# EAGLE design I2C_IO_card_v3.0 (EAGLE 9.6.2)

## Sheet 1 of 2: IO isolatet expander
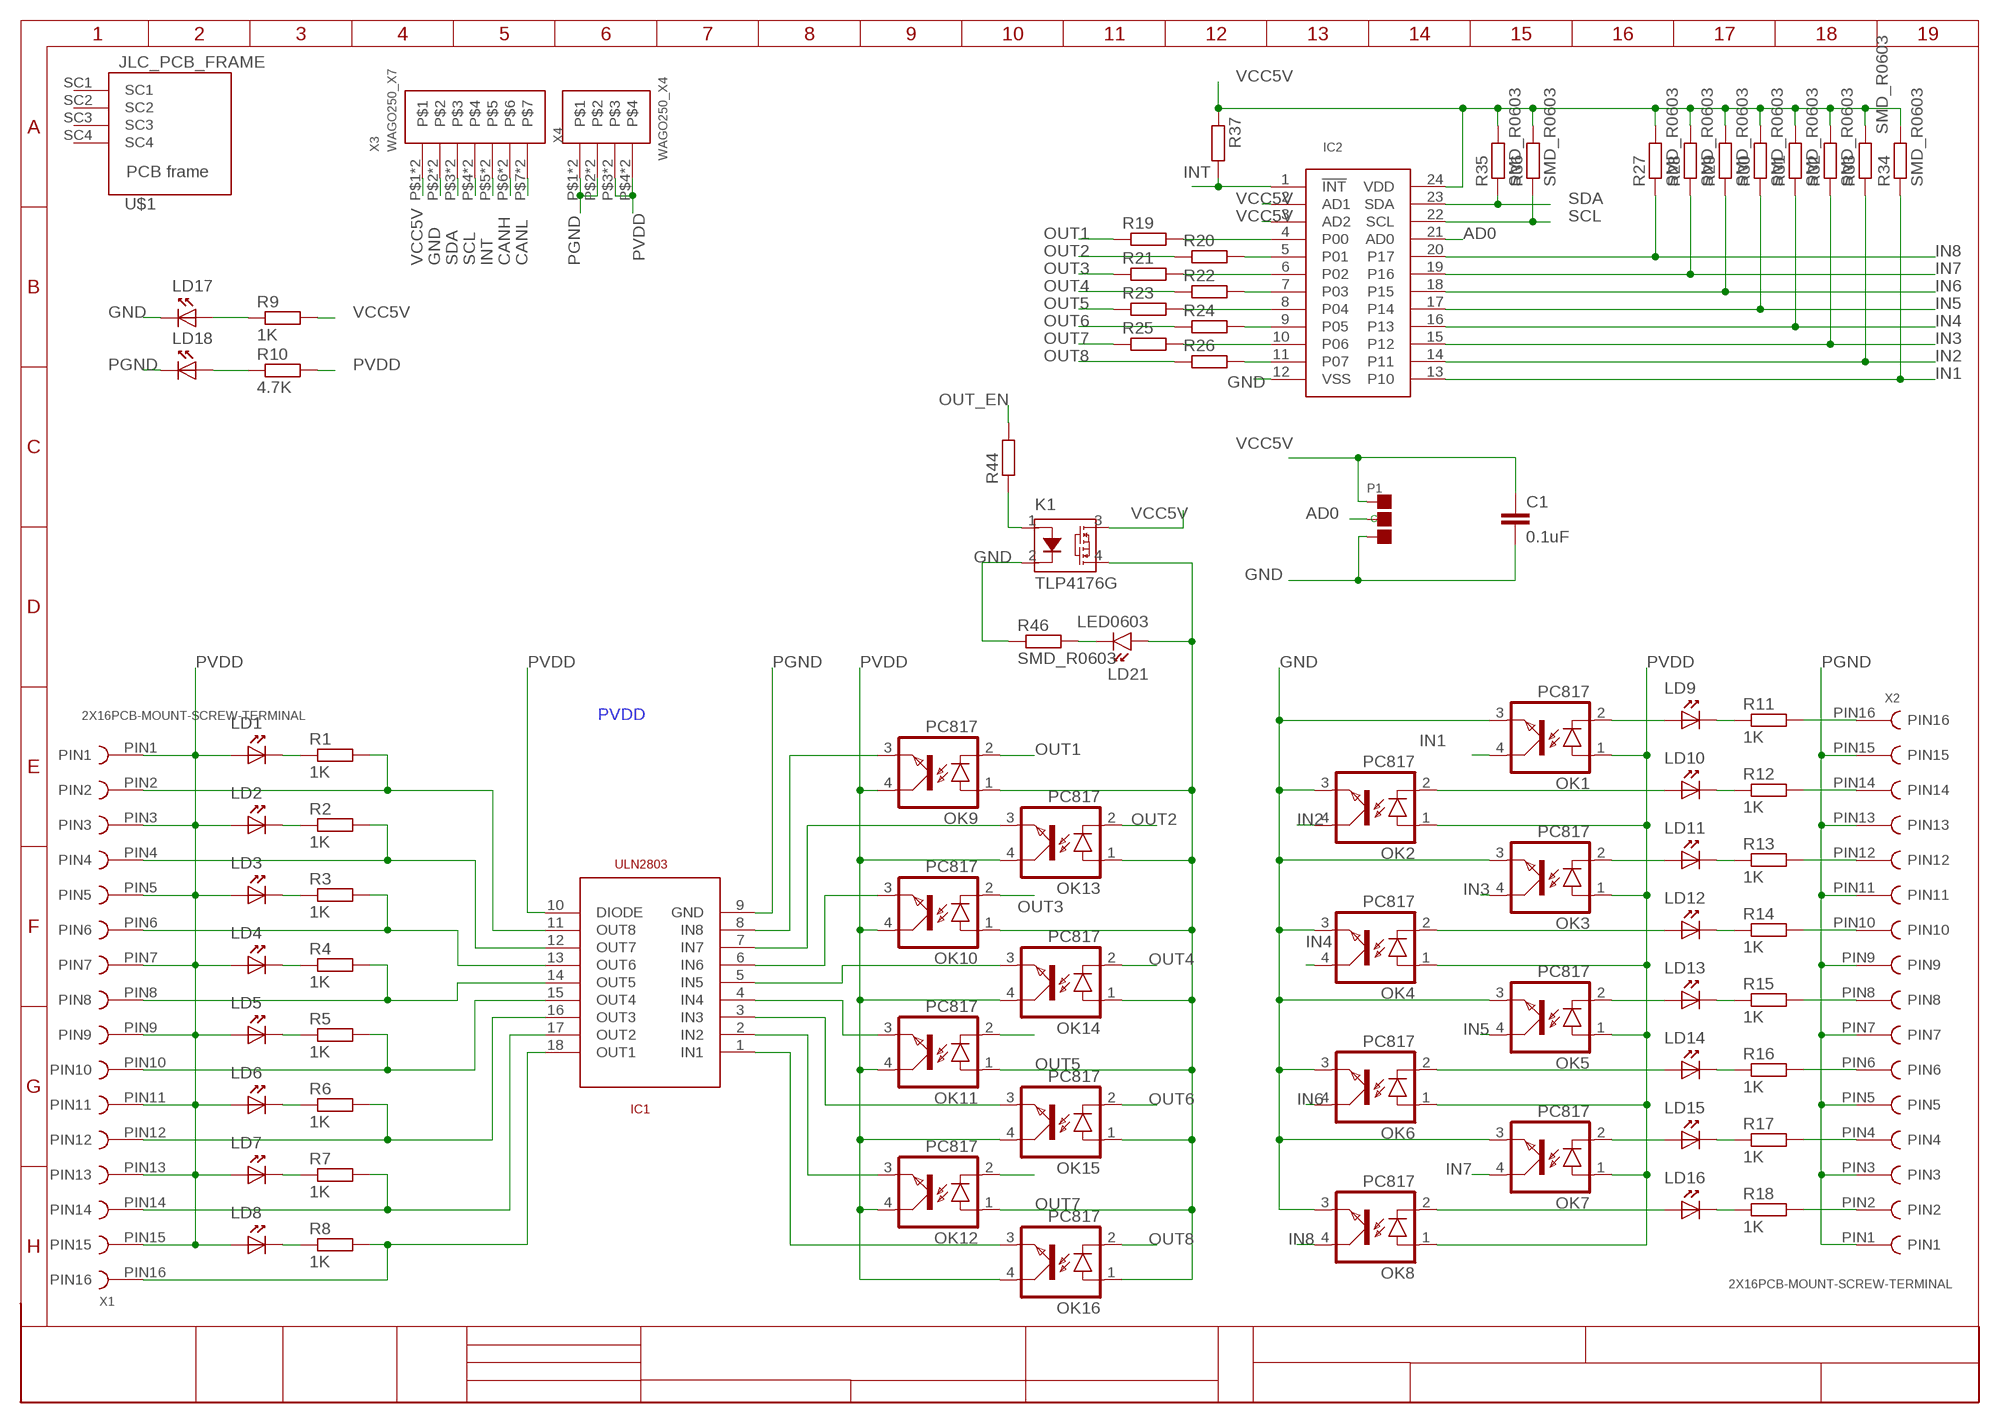
[diagram p0: schematic, sheet 1]

### Parts
C1  0.1uF  C-EUC0603K  [C0603K]
IC1  ULN2803  [SO18L]
IC2  PCA9675_TSSOP24  [SOP65P640X110-24N]
K1  TLP4176G  [SOP04]
LD1  LED  [LED_RADIAL_3MM]
LD2  LED  [LED_RADIAL_3MM]
LD3  LED  [LED_RADIAL_3MM]
LD4  LED  [LED_RADIAL_3MM]
LD5  LED  [LED_RADIAL_3MM]
LD6  LED  [LED_RADIAL_3MM]
LD7  LED  [LED_RADIAL_3MM]
LD8  LED  [LED_RADIAL_3MM]
LD9  LED  [LED_RADIAL_3MM]
LD10  LED  [LED_RADIAL_3MM]
LD11  LED  [LED_RADIAL_3MM]
LD12  LED  [LED_RADIAL_3MM]
LD13  LED  [LED_RADIAL_3MM]
LD14  LED  [LED_RADIAL_3MM]
LD15  LED  [LED_RADIAL_3MM]
LD16  LED  [LED_RADIAL_3MM]
LD17  LED  [LED_RADIAL_3MM]
LD18  LED  [LED_RADIAL_3MM]
LD21  LED0603  [0603_P]
OK1  PC817  [DIL04]
OK2  PC817  [DIL04]
OK3  PC817  [DIL04]
OK4  PC817  [DIL04]
OK5  PC817  [DIL04]
OK6  PC817  [DIL04]
OK7  PC817  [DIL04]
OK8  PC817  [DIL04]
OK9  PC817  [DIL04]
OK10  PC817  [DIL04]
OK11  PC817  [DIL04]
OK12  PC817  [DIL04]
OK13  PC817  [DIL04]
OK14  PC817  [DIL04]
OK15  PC817  [DIL04]
OK16  PC817  [DIL04]
P1  PAD-JUMPER-3P-40*40  [3P-SMD-4.1X1.5]
R1  1K  R-EU_R0603  [R0603]
R2  1K  R-EU_R0603  [R0603]
R3  1K  R-EU_R0603  [R0603]
R4  1K  R-EU_R0603  [R0603]
R5  1K  R-EU_R0603  [R0603]
R6  1K  R-EU_R0603  [R0603]
R7  1K  R-EU_R0603  [R0603]
R8  1K  R-EU_R0603  [R0603]
R9  1K  R-EU_R0603  [R0603]
R10  4.7K  R-EU_R0603  [R0603]
R11  1K  R-EU_R0603  [R0603]
R12  1K  R-EU_R0603  [R0603]
R13  1K  R-EU_R0603  [R0603]
R14  1K  R-EU_R0603  [R0603]
R15  1K  R-EU_R0603  [R0603]
R16  1K  R-EU_R0603  [R0603]
R17  1K  R-EU_R0603  [R0603]
R18  1K  R-EU_R0603  [R0603]
R19  SMD_R0603  [0603]
R20  SMD_R0603  [0603]
R21  SMD_R0603  [0603]
R22  SMD_R0603  [0603]
R23  SMD_R0603  [0603]
R24  SMD_R0603  [0603]
R25  SMD_R0603  [0603]
R26  SMD_R0603  [0603]
R27  SMD_R0603  [0603]
R28  SMD_R0603  [0603]
R29  SMD_R0603  [0603]
R30  SMD_R0603  [0603]
R31  SMD_R0603  [0603]
R32  SMD_R0603  [0603]
R33  SMD_R0603  [0603]
R34  SMD_R0603  [0603]
R35  SMD_R0603  [0603]
R36  SMD_R0603  [0603]
R37  R-EU_RO603K  [R0603K]
R44  SMD_R0603  [0603]
R46  SMD_R0603  [0603]
U$1  JLC_PCB_FRAME  [80X100_PCB_FRAME]
X1  2X16PCB-MOUNT-SCREW-TERMINAL  [2X16PCB-MOUNT-SCREW-TERMINAL]
X2  2X16PCB-MOUNT-SCREW-TERMINAL  [2X16PCB-MOUNT-SCREW-TERMINAL]
X3  WAGO250_X7  [WAGO250_FP_7X]
X4  WAGO250_X4  [WAGO250_FP_4X]

### Nets
AD0: IC2.21(AD0) P1.MM(C)
CANH: X3.P$6 X3.U$6 ; also sheet 2
CANL: X3.P$7 X3.U$7 ; also sheet 2
GND: C1.2 IC2.12(VSS) K1.2(K) LD17.K OK1.3(EMIT) OK2.3(EMIT) OK3.3(EMIT) OK4.3(EMIT) OK5.3(EMIT) OK6.3(EMIT) OK7.3(EMIT) OK8.3(EMIT) P1.11(R) R46.1 X3.P$2 X3.U$2 ; also sheet 2
IN1: IC2.13(P10) OK1.4(COL) R34.1 ; also sheet 2
IN2: IC2.14(P11) OK2.4(COL) R33.1
IN3: IC2.15(P12) OK3.4(COL) R32.1
IN4: IC2.16(P13) OK4.4(COL) R31.1
IN5: IC2.17(P14) OK5.4(COL) R30.1
IN6: IC2.18(P15) OK6.4(COL) R29.1
IN7: IC2.19(P16) OK7.4(COL) R28.1
IN8: IC2.20(P17) OK8.4(COL) R27.1
INT: IC2.1(!INT) R37.2 X3.P$5 X3.U$5 ; also sheet 2
N$1: LD1.K R1.1
N$2: LD2.K R2.1
N$3: LD3.K R3.1
N$4: LD4.K R4.1
N$5: LD5.K R5.1
N$6: LD6.K R6.1
N$7: LD7.K R7.1
N$8: LD8.K R8.1
N$9: IC1.18(OUT1) R8.2 X1.PIN16
N$10: IC1.17(OUT2) R7.2 X1.PIN14
N$11: IC1.16(OUT3) R6.2 X1.PIN12
N$12: IC1.15(OUT4) R5.2 X1.PIN10
N$13: IC1.14(OUT5) R4.2 X1.PIN8
N$14: IC1.13(OUT6) R3.2 X1.PIN6
N$15: IC1.12(OUT7) R2.2 X1.PIN4
N$16: IC1.11(OUT8) R1.2 X1.PIN2
N$17: LD17.A R9.1
N$18: LD18.A R10.1
N$19: R18.2 X2.PIN2
N$20: R17.2 X2.PIN4
N$21: R16.2 X2.PIN6
N$22: R15.2 X2.PIN8
N$23: R14.2 X2.PIN10
N$24: R13.2 X2.PIN12
N$25: R12.2 X2.PIN14
N$26: R11.2 X2.PIN16
N$27: LD9.K R11.1
N$28: LD10.K R12.1
N$29: LD11.K R13.1
N$30: LD12.K R14.1
N$31: LD13.K R15.1
N$32: LD14.K R16.1
N$33: LD15.K R17.1
N$34: LD16.K R18.1
N$35: LD9.A OK1.2(C)
N$36: LD11.A OK3.2(C)
N$37: LD13.A OK5.2(C)
N$38: LD15.A OK7.2(C)
N$39: LD16.A OK8.2(C)
N$40: LD14.A OK6.2(C)
N$41: LD12.A OK4.2(C)
N$42: LD10.A OK2.2(C)
N$43: IC2.4(P00) R19.2
N$44: IC1.8(IN8) OK9.3(EMIT)
N$45: IC1.7(IN7) OK13.3(EMIT)
N$46: IC1.6(IN6) OK10.3(EMIT)
N$47: IC1.5(IN5) OK14.3(EMIT)
N$48: IC1.4(IN4) OK11.3(EMIT)
N$49: IC1.3(IN3) OK15.3(EMIT)
N$50: IC1.2(IN2) OK12.3(EMIT)
N$51: IC1.1(IN1) OK16.3(EMIT)
N$52: IC2.5(P01) R20.2
N$53: IC2.6(P02) R21.2
N$54: IC2.7(P03) R22.2
N$55: IC2.8(P04) R23.2
N$56: IC2.9(P05) R24.2
N$57: IC2.10(P06) R25.2
N$58: IC2.11(P07) R26.2
N$67: K1.4(DS2) LD21.2(A) OK9.1(A) OK10.1(A) OK11.1(A) OK12.1(A) OK13.1(A) OK14.1(A) OK15.1(A) OK16.1(A)
N$73: K1.1(A) R44.1
N$75: LD21.1(K) R46.2
OUT1: OK9.2(C) R19.1
OUT2: OK13.2(C) R20.1
OUT3: OK10.2(C) R21.1
OUT4: OK14.2(C) R22.1
OUT5: OK11.2(C) R23.1
OUT6: OK15.2(C) R24.1
OUT7: OK12.2(C) R25.1
OUT8: OK16.2(C) R26.1
OUT_EN: R44.2 ; also sheet 2
PGND: IC1.9(GND) LD18.K X2.PIN1 X2.PIN3 X2.PIN5 X2.PIN7 X2.PIN9 X2.PIN11 X2.PIN13 X2.PIN15 X4.P$1 X4.P$2 X4.U$1 X4.U$2 ; also sheet 2
PVDD: IC1.10(DIODE) LD1.A LD2.A LD3.A LD4.A LD5.A LD6.A LD7.A LD8.A OK1.1(A) OK2.1(A) OK3.1(A) OK4.1(A) OK5.1(A) OK6.1(A) OK7.1(A) OK8.1(A) OK9.4(COL) OK10.4(COL) OK11.4(COL) OK12.4(COL) OK13.4(COL) OK14.4(COL) OK15.4(COL) OK16.4(COL) R10.2 X1.PIN1 X1.PIN3 X1.PIN5 X1.PIN7 X1.PIN9 X1.PIN11 X1.PIN13 X1.PIN15 X4.P$3 X4.P$4 X4.U$3 X4.U$4 ; also sheet 2
SCL: IC2.22(SCL) R36.1 X3.P$4 X3.U$4 ; also sheet 2
SDA: IC2.23(SDA) R35.1 X3.P$3 X3.U$3 ; also sheet 2
VCC5V: C1.1 IC2.2(AD1) IC2.3(AD2) IC2.24(VDD) K1.3(DS1) P1.00(L) R9.2 R27.2 R28.2 R29.2 R30.2 R31.2 R32.2 R33.2 R34.2 R35.2 R36.2 R37.1 X3.P$1 X3.U$1 ; also sheet 2
Unconnected: U$1.SC1 U$1.SC2 U$1.SC3 U$1.SC4

## Sheet 2 of 2: DC-DC power module
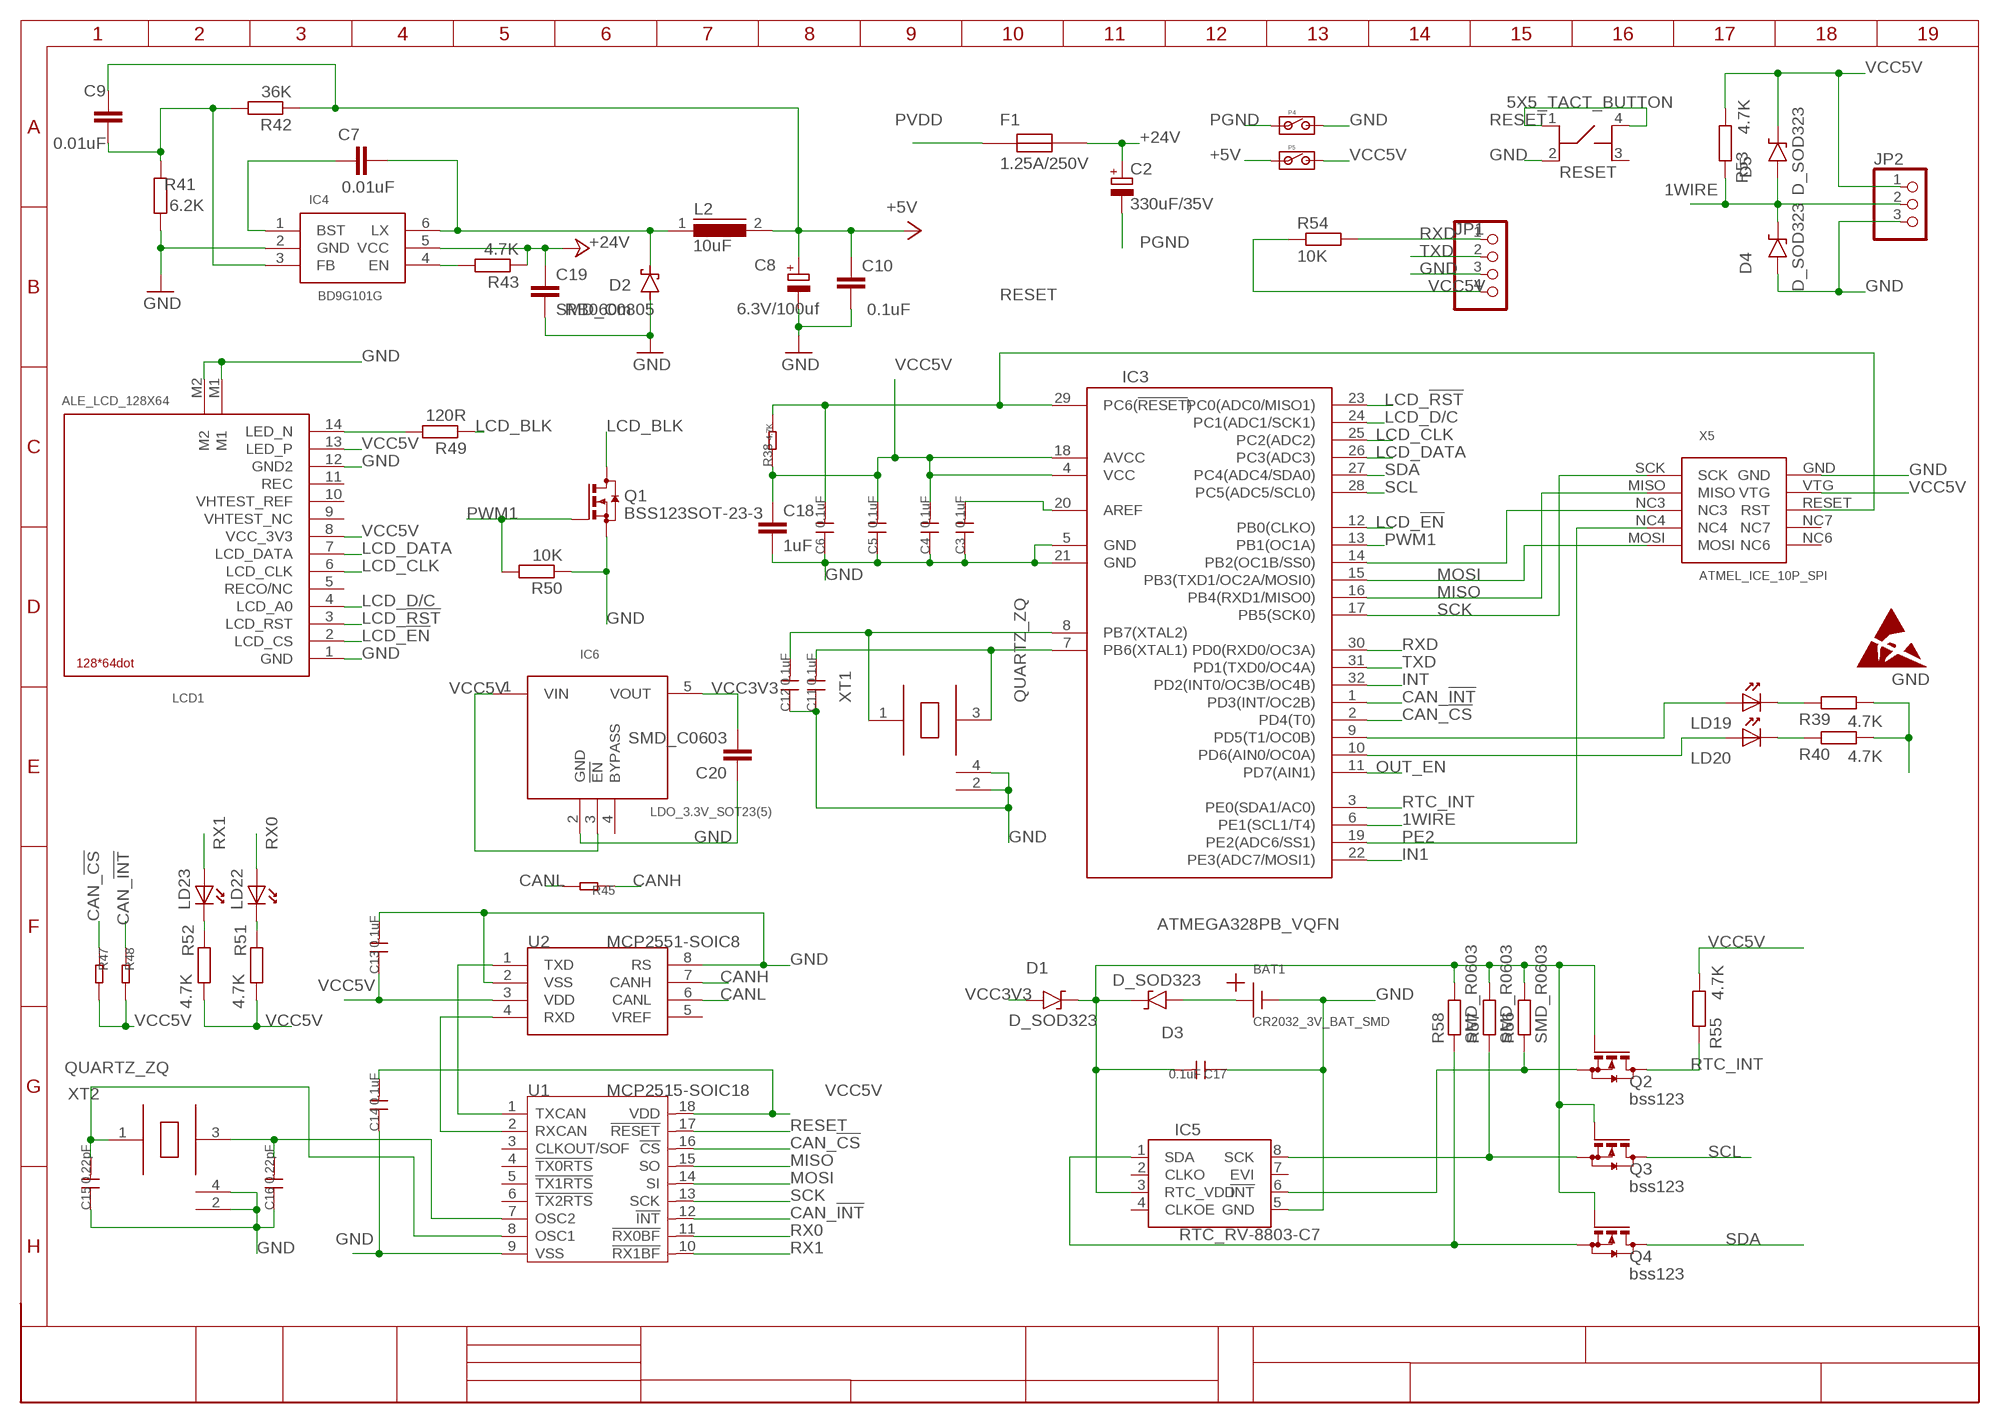
[diagram p1: schematic, sheet 2]

### Parts
BAT1  CR2032_3V_BAT_SMD  [CR2032_BAT]
C2  330uF/35V  CPOL-EUE5-10.5  [E5-10,5]
C3  0.1uF  C-0603  [0603]
C4  0.1uF  C-0603  [0603]
C5  0.1uF  C-0603  [0603]
C6  0.1uF  C-0603  [0603]
C7  0.01uF  SMD_C0603  [0603]
C8  6.3V/100uf  CPOL-EU140CLH-0810  [140CLH-0810]
C9  0.01uF  SMD_C0603  [0603]
C10  0.1uF  SMD_C0603  [0603]
C11  0.1uF  C-0603  [0603]
C12  0.1uF  C-0603  [0603]
C13  0.1uF  C-0603  [0603]
C14  0.1uF  C-0603  [0603]
C15  0.22pF  C-0603  [0603]
C16  0.22pF  C-0603  [0603]
C17  0.1uF  C-0603  [0603]
C18  1uF  C-EUC1206K  [C1206K]
C19  SMD_C0805  [0805]
C20  SMD_C0603  [0603]
D1  D_SOD323  [SOD-323_D]
D2  RB060m  MBRS130LT3  [SMB]
D3  D_SOD323  [SOD-323_D]
D4  D_SOD323  [SOD-323_D]
D5  D_SOD323  [SOD-323_D]
F1  1.25A/250V  FUSE  [FUSE_DIP_2.5A250V]
IC3  ATMEGA328PB_VQFN  [MLF32]
IC4  BD9G101G  BD9G101G_SOT23(6)  [SOT-23(6)]
IC5  RTC_RV-8803-C7  [C7_RTC]
IC6  LDO_3.3V_SOT23(5)  [SOT-23(5)]
JP1  PINHD-1X4  [1X04]
JP2  PINHD-1X3  [1X03]
L2  10uF  DR74  [DR74]
LCD1  ALE_LCD_128X64  [ALE_LCD_14PIN_CONNECTOR]
LD19  LEDLED_SMD_0603  [D0603K]
LD20  LEDLED_SMD_0603  [D0603K]
LD22  LEDLED_SMD_0603  [D0603K]
LD23  LEDLED_SMD_0603  [D0603K]
P4  PAD-JUMPER-2P  [2P-SMD-1.78X1.27]
P5  PAD-JUMPER-2P  [2P-SMD-1.78X1.27]
Q1  BSS123SOT-23-3  [SOT-23(3)]
Q2  bss123  BSS123SOT-23-3  [SOT-23(3)]
Q3  bss123  BSS123SOT-23-3  [SOT-23(3)]
Q4  bss123  BSS123SOT-23-3  [SOT-23(3)]
R38  4.7K  R-0603  [0603]
R39  4.7K  R-EU_RO603K  [R0603K]
R40  4.7K  R-EU_RO603K  [R0603K]
R41  6.2K  SMD_R0603  [0603]
R42  36K  SMD_R0603  [0603]
R43  4.7K  SMD_R0603  [0603]
R45  R-0603  [0603]
R47  R-0603  [0603]
R48  R-0603  [0603]
R49  120R  SMD_R0603  [0603]
R50  10K  SMD_R0603  [0603]
R51  4.7K  R-EU_RO603K  [R0603K]
R52  4.7K  R-EU_RO603K  [R0603K]
R53  4.7K  R-EU_RO603K  [R0603K]
R54  10K  SMD_R0603  [0603]
R55  4.7K  SMD_R0603  [0603]
R56  SMD_R0603  [0603]
R57  SMD_R0603  [0603]
R58  SMD_R0603  [0603]
RESET  5X5_TACT_BUTTON  [5X5_4PIN_TACT_BUTTON]
U1  MCP2515-SOIC18  [SOIC18]
U2  MCP2551-SOIC8  [SOIC8-6.0]
X5  ATMEL_ICE_10P_SPI  [ATMEL_ISP_2X5PIN_SMD]
XT1  QUARTZ_ZQ  [QUARTZ_3X3MM]
XT2  QUARTZ_ZQ  [QUARTZ_3X3MM]

### Nets
1WIRE: D4.K D5.A IC3.6(PE1(SCL1/T4)) JP2.2 R53.2
+5V: C8.+ C9.2 C10.2 L2.2 P5.1 R42.1
+24V: C2.+ C19.1 F1.P$2 IC4.5(VCC) R43.1
CAN_!CS: IC3.2(PD4(T0)) R47.1 U1.16(!CS)
CAN_!INT: IC3.1(PD3(INT/OC2B)) R48.1 U1.12(!INT)
CANH: R45.1 U2.7(CANH) ; also sheet 1
CANL: R45.2 U2.6(CANL) ; also sheet 1
GND: BAT1.P$2(-) C3.1 C4.1 C5.1 C6.1 C11.1 C12.1 C13.2 C14.1 C15.1 C16.1 C17.1 C18.2 C20.1 D4.A IC3.5(GND) IC3.21(GND) IC5.5(GND) IC6.2(GND) JP1.3 JP2.3 LCD1.1(GND) LCD1.12(GND2) LCD1.M1 LCD1.M2 P4.2 Q1.2(S) R39.1 R40.1 R50.1 RESET.2 U1.9(VSS) U2.2(VSS) U2.8(RS) X5.GND XT1.2(GND1) XT1.4(GND2) XT2.2(GND1) XT2.4(GND2) ; also sheet 1
IN1: IC3.22(PE3(ADC7/MOSI1)) ; also sheet 1
INT: IC3.32(PD2(INT0/OC3B/OC4B)) ; also sheet 1
LCD_!EN: IC3.12(PB0(CLKO)) LCD1.2(LCD_CS)
LCD_!RST: IC3.23(PC0(ADC0/MISO1)) LCD1.3(LCD_RST)
LCD_BLK: Q1.3(D) R49.1
LCD_CLK: IC3.25(PC2(ADC2)) LCD1.6(LCD_CLK)
LCD_D/C: IC3.24(PC1(ADC1/SCK1)) LCD1.4(LCD_A0)
LCD_DATA: IC3.26(PC3(ADC3)) LCD1.7(LCD_DATA)
MISO: IC3.16(PB4(RXD1/MISO0)) U1.15(SO) X5.MISO
MOSI: IC3.15(PB3(TXD1/OC2A/MOSI0)) U1.14(SI) X5.MOSI
N$59: LCD1.14(LED_N) R49.2
N$60: C3.2 IC3.20(AREF)
N$61: C17.2 D1.K D3.K IC5.3(RTC_VDD) Q2.1(G) Q3.1(G) Q4.1(G) R56.2 R57.2 R58.2
N$62: BAT1.P$1(+) D3.A
N$63: C7.1 IC4.1(BST)
N$64: C7.2 D2.C IC4.6(LX) L2.1
N$65: C9.1 IC4.3(FB) R41.2 R42.2
N$66: IC4.4(EN) R43.2
N$68: LD19.K-(K) R39.2
N$69: C12.2 IC3.8(PB7(XTAL2)) XT1.1
N$70: C11.2 IC3.7(PB6(XTAL1)) XT1.3
N$71: IC3.14(PB2(OC1B/SS0)) X5.NC3
N$72: LD20.K-(K) R40.2
N$74: U1.1(TXCAN) U2.1(TXD)
N$76: IC3.10(PD6(AIN0/OC0A)) LD20.A+(A)
N$77: IC3.9(PD5(T1/OC0B)) LD19.A+(A)
N$78: U1.2(RXCAN) U2.4(RXD)
N$79: IC5.1(SDA) Q4.2(S) R58.1
N$80: C16.2 U1.7(OSC2) XT2.3
N$81: C15.2 U1.8(OSC1) XT2.1
N$82: LD22.K-(K) R51.2
N$83: LD23.K-(K) R52.2
N$85: IC5.8(SCK) Q3.2(S) R57.1
N$86: IC5.6(!INT) Q2.2(S) R56.1
OUT_EN: IC3.11(PD7(AIN1)) ; also sheet 1
PE2: IC3.19(PE2(ADC6/SS1)) X5.NC4
PGND: C2.- C8.- C10.1 C19.2 D2.A IC4.2(GND) P4.1 R41.1 ; supply symbol labelled GND ; also sheet 1
PVDD: F1.P$1 ; also sheet 1
PWM1: IC3.13(PB1(OC1A)) Q1.1(G) R50.2
RESET: C6.2 IC3.29(PC6(!RESET!)) R38.2 RESET.1 RESET.4 U1.17(!RESET) X5.RESET(RST)
RTC_INT: IC3.3(PE0(SDA1/AC0)) Q2.3(D) R55.2
RX0: LD22.A+(A) U1.11(!RX0BF)
RX1: LD23.A+(A) U1.10(!RX1BF)
RXD: IC3.30(PD0(RXD0/OC3A)) JP1.1 R54.2
SCK: IC3.17(PB5(SCK0)) U1.13(SCK) X5.SCK
SCL: IC3.28(PC5(ADC5/SCL0)) Q3.3(D) ; also sheet 1
SDA: IC3.27(PC4(ADC4/SDA0)) Q4.3(D) ; also sheet 1
TXD: IC3.31(PD1(TXD0/OC4A)) JP1.2
VCC3V3: C20.2 D1.A IC6.5(VOUT)
VCC5V: C4.2 C5.2 C13.1 C14.2 C18.1 D5.K IC3.4(VCC) IC3.18(AVCC) IC6.1(VIN) IC6.3(!EN!) JP1.4 JP2.1 LCD1.8(VCC_3V3) LCD1.13(LED_P) P5.2 R38.1 R47.2 R48.2 R51.1 R52.1 R53.1 R54.1 R55.1 U1.18(VDD) U2.3(VDD) X5.VTG ; also sheet 1
Unconnected: IC5.2(CLKO) IC5.4(CLKOE) IC5.7(EVI) IC6.4(BYPASS) LCD1.5(RECO/NC) LCD1.9(VHTEST_NC) LCD1.10(VHTEST_REF) LCD1.11(REC) RESET.3 U1.3(CLKOUT/SOF) U1.4(!TX0RTS) U1.5(!TX1RTS) U1.6(!TX2RTS) U2.5(VREF) X5.NC6 X5.NC7

## Library data of the parts
BAT1 = rcl:CR2032_3V_BAT_SMD
C1 C18 = rcl:C-EU: CAPACITOR, European symbol
C2 = rcl:CPOL-EU: POLARIZED CAPACITOR, European symbol
C3-C6 C11-C17 = Discrete:C*: Ceramic Capacitors
C7 C9 C10 C19 C20 = passive_components:SMD_C
C8 = rcl:CPOL-EU: POLARIZED CAPACITOR, European symbol; SPICEPREFIX: C
D1 D3-D5 = rcl:D_SOD323
D2 = diode:MBRS130LT3: Schottky Power Rectifier Source: http://www.onsemi.com/pub/Collateral/MBRS130LT3-D.PDF
F1 = Power:FUSE
IC1 = uln2803:ULN2803
IC2 = i2c_port_expander:PCA9675_TSSOP24
IC3 = my_lib:ATMEGA328PB_VQFN
IC4 = my_lib:BD9G101G_SOT23(6)
IC5 = my_lib:RTC_RV-8803-C7
IC6 = passive_components:LDO_3.3V_SOT23(5)
JP1 = pinhead:PINHD-1X4: PIN HEADER
JP2 = pinhead:PINHD-1X3: PIN HEADER
K1 = relays:TLP4176G
L2 = inductors:DR74: High Power Density, High Efficiency, Shielded Inductors Source: coiltronics_dr_series.pdf; SPICEPREFIX: L
LCD1 = passive_components:ALE_LCD_128X64
LD1-LD20 LD22 LD23 = rcl:LED
LD21 = passive_components:LED
OK1-OK16 = optocoupler:PC817: SHARP OPTO COUPLER; MPN: PC817X4J000F; OC_FARNELL: 9707727; OC_NEWARK: 97K7059
P1 = Discrete:PAD-JUMPER-3P
P4 P5 = Discrete:PAD-JUMPER-2P
Q1-Q4 = passive_components:BSS123: N-CHANNEL MOS FET
R1-R18 = rcl:R-EU_: RESISTOR, European symbol; SPICEPREFIX: R
R19-R36 R41-R44 R46 R49 R50 R54-R58 = passive_components:SMD_R
R37 R39 R40 R51-R53 = rcl:R-EU_: RESISTOR, European symbol
R38 R45 R47 R48 = Discrete:R*
RESET = passive_components:5X5_TACT_BUTTON
U1 = MCP_CAN:MCP2515: Stand-Alone CAN Controller With SPI Interface
U2 = MCP_CAN:MCP2551: High-Speed CAN Transceiver http://ww1.microchip.com/downloads/en/devicedoc/21667f.pdf
U$1 = passive_components:JLC_PCB_FRAME
X1 X2 = Wago_250:2X16PCB-MOUNT-SCREW-TERMINAL
X3 = Wago_250:WAGO250_X7
X4 = Wago_250:WAGO250_X4
X5 = avr-7:ATMEL_ICE_10P_SPI
XT1 XT2 = passive_components:QUARTZ_ZQ

## Board
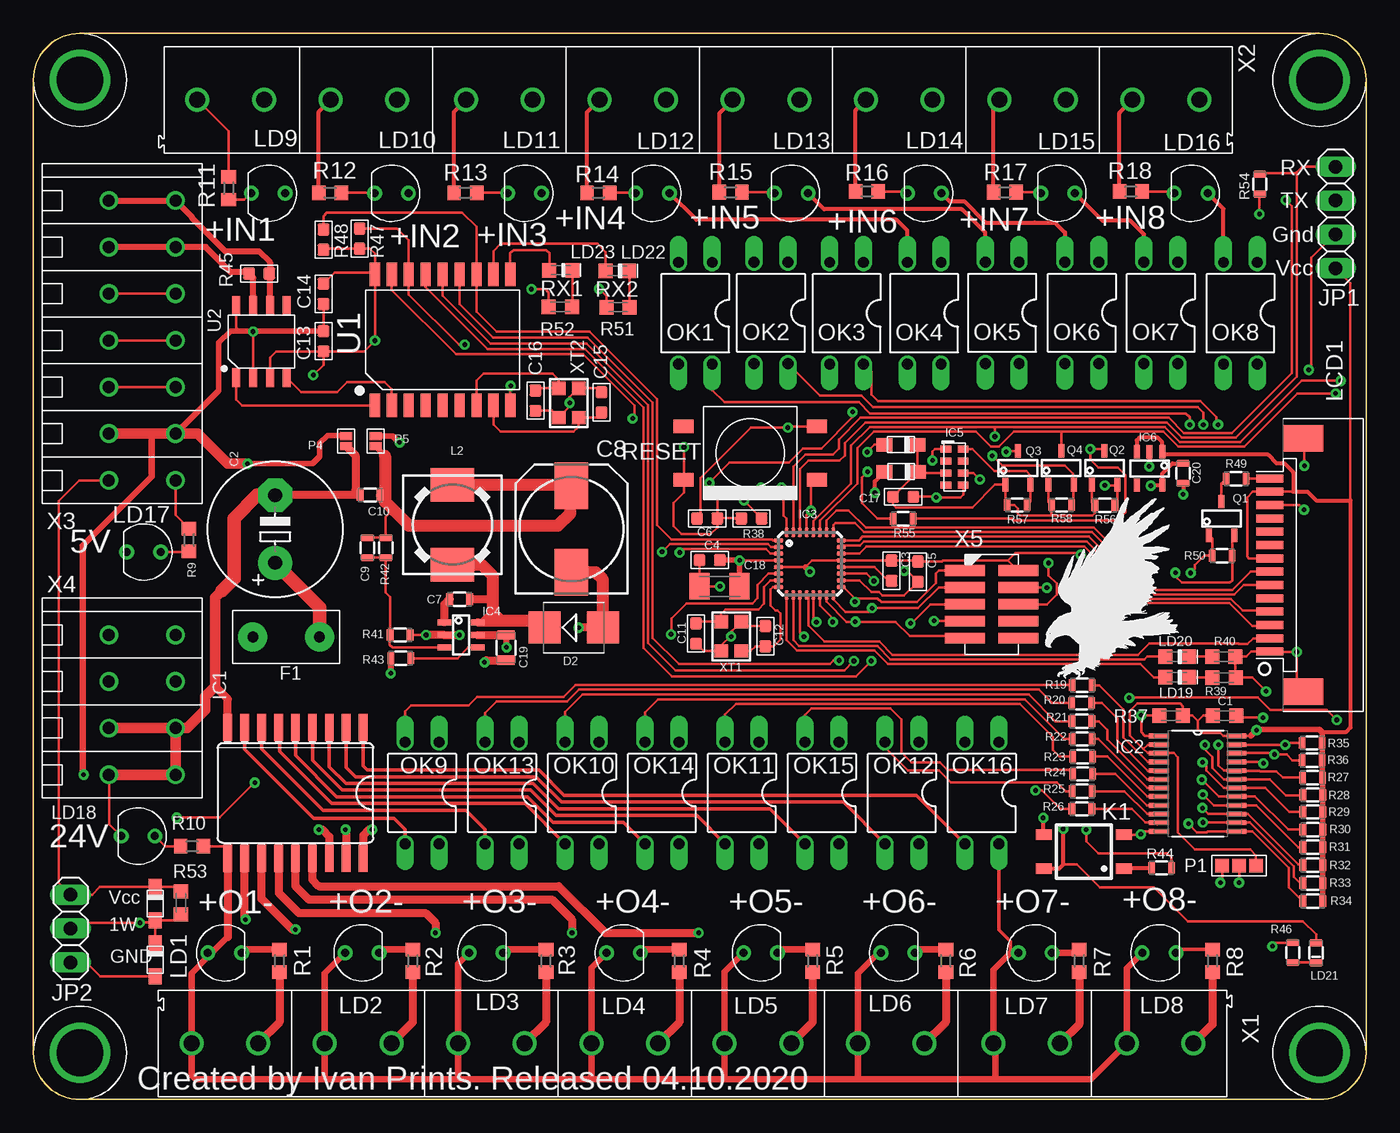
[diagram p2: board, top side]
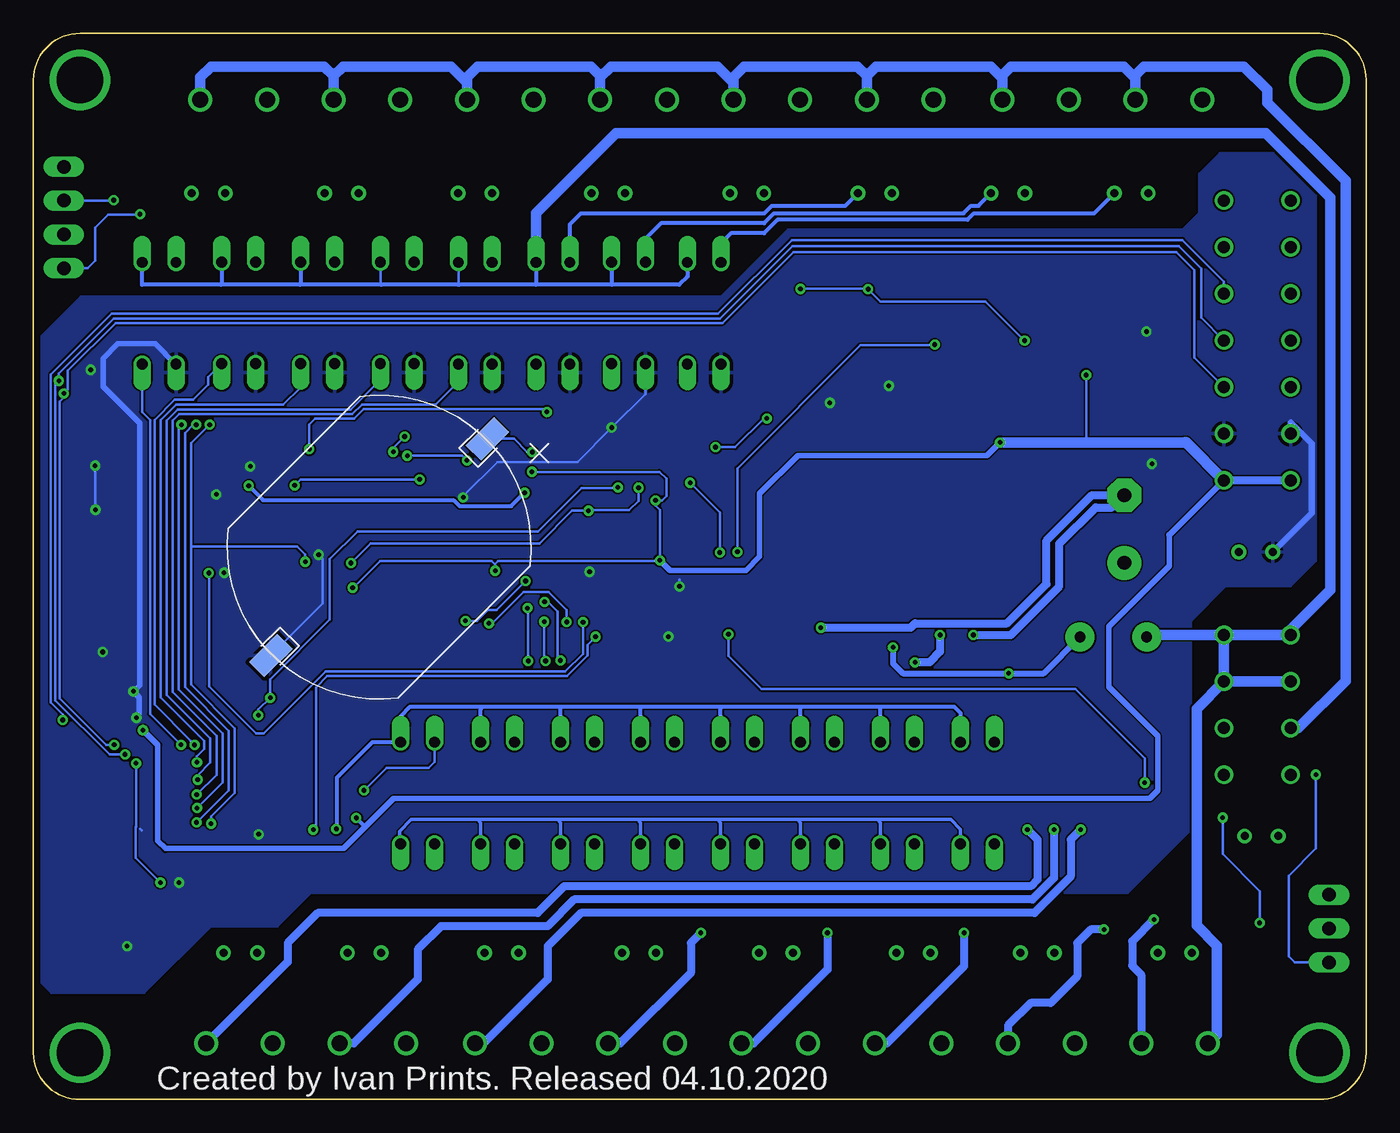
[diagram p3: board, bottom side, seen from below]

Size 100 x 80 mm. Coordinates in mm from the lower left corner, seen from the top.
Copper layers (1*16): Top 0.035mm / dielectric 1.5mm / Bottom 0.035mm
Design rules "default *": minimum track width 8mil, minimum drill 0.35mm, track to track 5mil, track to pad 5mil, pad to pad 5mil, via to via 10mil, smd to smd 5mil, copper to edge 20mil, drill to drill 6mil, minimum pad ring 10mil, minimum via ring 8mil, stop-mask expansion 4mil, vias tented up to drill 14mil, thermal gap 10mil

### Footprints (pad centres in the part's own frame; a part is rotated, then mirrored left to right if it is on the bottom)
CR2032_BAT = smd 3 x 1.6: P$1 -11.5,0; P$2 11.5,0
C0603K = smd 1.05 x 1.08: 1 -0.875,0; 2 0.875,0
E5-10,5 = drill 1.016 pad 2.54: + -2.54,0 | drill 1.016 pad 2.54 octagon: - 2.54,0
0603 = smd 0.889 x 0.889: 1 -0.762,0; 2 0.762,0
0603' = smd 0.85 x 0.5: 1 0,0.75; 2 0,-0.75
140CLH-0810 = smd 3.5 x 2.5: + 3.25,0; - -3.25,0
C1206K = smd 1.5 x 2: 1 -1.5,0; 2 1.5,0
0805 = smd 1.3 x 0.7: 1 0,0.95; 2 0,-0.95
SOD-323_D = smd 1.2 x 1: A 1.25,0; K -1.25,0
SMB = smd 2.4 x 2.4: A 2.2,0; C -2.2,0
FUSE_DIP_2.5A250V = drill 0.8 pad 2.184: P$1 -2.5,0; P$2 2.5,0
SO18L = smd 0.66 x 2.032: 1 -5.08,-4.902; 2 -3.81,-4.902; 3 -2.54,-4.902; 4 -1.27,-4.902; 5 0,-4.902; 6 1.27,-4.902; 7 2.54,-4.902; 8 3.81,-4.902; 9 5.08,-4.902; 10 5.08,4.902; 11 3.81,4.902; 12 2.54,4.902; 13 1.27,4.902; 14 0,4.902; 15 -1.27,4.902; 16 -2.54,4.902; 17 -3.81,4.902; 18 -5.08,4.902
SOP65P640X110-24N = smd 1.473 x 0.356: 1 -2.921,3.581; 2 -2.921,2.921; 3 -2.921,2.286; 4 -2.921,1.626; 5 -2.921,0.965; 6 -2.921,0.33; 7 -2.921,-0.33; 8 -2.921,-0.965; 9 -2.921,-1.626; 10 -2.921,-2.286; 11 -2.921,-2.921; 12 -2.921,-3.581; 13 2.921,-3.581; 14 2.921,-2.921; 15 2.921,-2.286; 16 2.921,-1.626; 17 2.921,-0.965; 18 2.921,-0.33; 19 2.921,0.33; 20 2.921,0.965; 21 2.921,1.626; 22 2.921,2.286; 23 2.921,2.921; 24 2.921,3.581
MLF32 = smd 0.7 x 0.3: 1 -2.35,1.75; 2 -2.35,1.25; 3 -2.35,0.75; 4 -2.35,0.25; 5 -2.35,-0.25; 6 -2.35,-0.75; 7 -2.35,-1.25; 8 -2.35,-1.75; 17 2.35,-1.75; 18 2.35,-1.25; 19 2.35,-0.75; 20 2.35,-0.25; 21 2.35,0.25; 22 2.35,0.75; 23 2.35,1.25; 24 2.35,1.75 | smd 0.3 x 0.7: 9 -1.75,-2.35; 10 -1.25,-2.35; 11 -0.75,-2.35; 12 -0.25,-2.35; 13 0.25,-2.35; 14 0.75,-2.35; 15 1.25,-2.35; 16 1.75,-2.35; 25 1.75,2.35; 26 1.25,2.35; 27 0.75,2.35; 28 0.25,2.35; 29 -0.25,2.35; 30 -0.75,2.35; 31 -1.25,2.35; 32 -1.75,2.35
SOT-23(6) = smd 0.45 x 1: 1 -0.95,-1.25; 2 0,-1.25; 3 0.95,-1.25; 4 0.95,1.25; 5 0,1.25; 6 -0.95,1.25
C7_RTC = smd 0.8 x 0.5: 1 -0.65,1.35; 2 -0.65,0.45; 3 -0.65,-0.45; 4 -0.65,-1.35; 5 0.65,-1.35; 6 0.65,-0.45; 7 0.65,0.45; 8 0.65,1.35
SOT-23(5) = smd 0.45 x 1: 1 -0.95,-1.25; 2 0,-1.25; 3 0.95,-1.25; 4 0.95,1.25; 5 -0.95,1.25
1X04 = drill 1.016 long: 1 -3.81,0; 2 -1.27,0; 3 1.27,0; 4 3.81,0
1X03 = drill 1.016 long: 1 -2.54,0; 2 0,0; 3 2.54,0
SOP04 = smd 0.8 x 1.2: 1 -1.27,-3; 2 1.27,-3; 3 1.27,3; 4 -1.27,3
DR74 = smd 2.5 x 3.25: 1 -3,0; 2 3,0
ALE_LCD_14PIN_CONNECTOR = smd 0.6 x 2: 1 6.5,-1; 2 5.5,-1; 3 4.5,-1; 4 3.5,-1; 5 2.5,-1; 6 1.5,-1; 7 0.5,-1; 8 -0.5,-1; 9 -1.5,-1; 10 -2.5,-1; 11 -3.5,-1; 12 -4.5,-1; 13 -5.5,-1; 14 -6.5,-1 | smd 2 x 3: M1 9.5,1.5; M2 -9.5,1.5
LED_RADIAL_3MM = drill 0.6: A -1.27,0; K 1.27,0
D0603K = smd 1.05 x 1.08: A+ 0.875,0; K- -0.875,0
0603_P = smd 0.85 x 0.5: 1 0,0.75; 2 0,-0.75
DIL04 = drill 0.813 offset: 1 -1.27,-3.81; 2 1.27,-3.81; 3 1.27,3.81; 4 -1.27,3.81
3P-SMD-4.1X1.5 = smd 1.016 x 1.016: 00 -1.27,0; 11 1.27,0; MM 0,0
2P-SMD-1.78X1.27 = smd 0.889 x 0.61: 1 0,0.381; 2 0,-0.381
SOT-23(3) = smd 0.45 x 1: 1 -0.95,-1.25; 2 0.95,-1.25; 3 0,1.29
R0603 = smd 1 x 1.1: 1 -0.85,0; 2 0.85,0
R0603K = smd 1.05 x 1.08: 1 -0.875,0; 2 0.875,0
5X5_4PIN_TACT_BUTTON = smd 1.5 x 1: 1 -5,2; 2 -5,-2; 3 5,-2; 4 5,2
SOIC18 = smd 0.762 x 1.778: 1 -5.08,-4.915; 2 -3.81,-4.915; 3 -2.54,-4.915; 4 -1.27,-4.915; 5 0,-4.915; 6 1.27,-4.915; 7 2.54,-4.915; 8 3.81,-4.915; 9 5.08,-4.915; 10 5.08,4.915; 11 3.81,4.915; 12 2.54,4.915; 13 1.27,4.915; 14 0,4.915; 15 -1.27,4.915; 16 -2.54,4.915; 17 -3.81,4.915; 18 -5.08,4.915
SOIC8-6.0 = smd 0.6 x 1.4: 1 -1.905,-2.7; 2 -0.635,-2.7; 3 0.635,-2.7; 4 1.905,-2.7; 5 1.905,2.7; 6 0.635,2.7; 7 -0.635,2.7; 8 -1.905,2.7
80X100_PCB_FRAME = drill 3.5: SC1 3.5,96.5; SC2 76.5,96.5; SC3 3.5,3.5; SC4 76.5,3.5
2X16PCB-MOUNT-SCREW-TERMINAL = drill 1.2: PIN1 0,2.5; PIN2 0,-2.5; PIN3 0,-7.5; PIN4 0,-12.5; PIN5 0,-17.5; PIN6 0,-22.5; PIN7 0,-27.5; PIN8 0,-32.5; PIN9 0,-37.5; PIN10 0,-42.5; PIN11 0,-47.5; PIN12 0,-52.5; PIN13 0,-57.66; PIN14 0,-62.66; PIN15 0,-67.66; PIN16 0,-72.66
WAGO250_FP_7X = drill 0.9: P$1 0,5; P$2 3.5,5; P$3 7,5; P$4 10.5,5; P$5 14,5; P$6 17.5,5; P$7 21,5; U$1 0,0; U$2 3.5,0; U$3 7,0; U$4 10.5,0; U$5 14,0; U$6 17.5,0; U$7 21,0
WAGO250_FP_4X = drill 0.9: P$1 0,5; P$2 3.5,5; P$3 7,5; P$4 10.5,5; U$1 0,0; U$2 3.5,0; U$3 7,0; U$4 10.5,0
ATMEL_ISP_2X5PIN_SMD = smd 3 x 0.8: GND 2,2.54; MISO -2,1.27; MOSI -2,-2.54; NC3 -2,0; NC4 -2,-1.27; NC6 2,-2.54; NC7 2,-1.27; RESET 2,0; SCK -2,2.54; VTG 2,1.27
QUARTZ_3X3MM = smd 1 x 1: 1 -0.75,1.1; 2 0.75,1.1; 3 0.75,-1.1; 4 -0.75,-1.1

### Placement (x,y rotation side)
BAT1  74.06,41.44 225 bottom
C1  89.37,28.8 0 top
C2  18.15,42.8 90 top
C3  64.39,39.67 270 top
C4  50.75,40.47 0 top
C5  66.37,39.6 270 top
C6  50.56,43.6 0 top
C7  0.01uF  [0603']  31.98,37.55 90 top
C8  40.37,42.8 90 top
C9  0.01uF  [0603']  25.07,41.4 180 top
C10  0.1uF  [0603']  25.27,45.35 90 top
C11  49.72,34.96 90 top
C12  54.92,34.76 270 top
C13  21.77,56.9 90 top
C14  21.77,60.45 90 top
C15  42.63,52.31 270 top
C16  37.68,52.44 90 top
C17  65.27,45.23 180 top
C18  51.5,38.5 180 top
C19  35.47,33.9 0 top
C20  SMD_C0603  [0603']  86.27,46.98 180 top
D1  65.12,47.1 180 top
D2  40.55,35.4 0 top
D3  65.09,49.12 180 top
D4  9.15,10.47 270 top
D5  9.15,14.7 270 top
F1  18.97,34.7 0 top
IC1  19.67,23 180 top
IC2  87.37,23.7 0 top
IC3  58.27,40.2 0 top
IC4  32.09,34.85 270 top
IC5  69.12,47.45 0 top
IC6  83.75,47.35 180 top
JP1  97.72,66.18 270 top
JP2  2.8,12.82 270 top
K1  78.82,18.6 90 top
L2  31.45,43.12 90 top
LCD1  93.77,40.1 270 top
LD1  14.37,11 0 top
LD2  24.67,11 0 top
LD3  33.97,11 0 top
LD4  44.27,11 0 top
LD5  54.57,11 0 top
LD6  64.87,11 0 top
LD7  75.17,11 0 top
LD8  84.47,11 0 top
LD9  17.63,68 180 top
LD10  26.87,68 180 top
LD11  36.87,68 180 top
LD12  46.47,68 180 top
LD13  56.87,68 180 top
LD14  66.87,68 180 top
LD15  76.87,68 180 top
LD16  86.87,68 180 top
LD17  8.29,41.08 180 top
LD18  7.86,19.76 180 top
LD19  85.82,31.68 180 top
LD20  85.82,33.23 180 top
LD21  96.25,11 180 top
LD22  43.82,62.17 180 top
LD23  39.57,62.23 180 top
OK1  49.67,59 180 top
OK2  55.34,59.02 180 top
OK3  61.02,59 180 top
OK4  66.84,59 180 top
OK5  72.7,59.02 180 top
OK6  78.67,59.02 180 top
OK7  84.59,59.02 180 top
OK8  90.57,59 180 top
OK9  29.17,23 180 top
OK10  41.17,23 180 top
OK11  53.17,23 180 top
OK12  65.17,23 180 top
OK13  35.17,23 180 top
OK14  47.17,23 180 top
OK15  59.17,23 180 top
OK16  71.17,23 180 top
P1  90.47,17.55 180 top
P4  23.47,49.4 180 top
P5  25.67,49.4 180 top
Q1  89.14,43.58 0 top
Q2  80.37,47.38 0 top
Q3  73.87,47.38 0 top
Q4  77.12,47.38 0 top
R1  18.47,10.4 270 top
R2  28.47,10.4 270 top
R3  38.47,10.4 270 top
R4  48.47,10.4 270 top
R5  58.47,10.4 270 top
R6  68.47,10.4 270 top
R7  78.47,10.4 270 top
R8  88.47,10.4 270 top
R9  11.68,41.98 90 top
R10  11.91,19 0 top
R11  14.66,68.37 90 top
R12  22.27,68.03 180 top
R13  32.42,68.03 180 top
R14  42.4,68.03 180 top
R15  52.32,68.08 180 top
R16  62.55,68.12 180 top
R17  72.89,68.08 180 top
R18  82.34,68.12 180 top
R19  [0603']  78.7,31.07 90 top
R20  [0603']  78.64,29.75 90 top
R21  [0603']  78.67,28.38 90 top
R22  [0603']  78.7,27.05 90 top
R23  [0603']  78.72,25.73 90 top
R24  [0603']  78.72,24.43 90 top
R25  [0603']  78.7,23.12 90 top
R26  [0603']  78.67,21.8 90 top
R27  SMD_R0603  [0603']  95.97,24.15 90 top
R28  SMD_R0603  [0603']  96,22.85 90 top
R29  SMD_R0603  [0603']  96,21.57 90 top
R30  SMD_R0603  [0603']  96,20.25 90 top
R31  SMD_R0603  [0603']  96,18.93 90 top
R32  SMD_R0603  [0603']  96,17.57 90 top
R33  SMD_R0603  [0603']  96,16.23 90 top
R34  SMD_R0603  [0603']  96,14.88 90 top
R35  SMD_R0603  [0603']  95.95,26.75 90 top
R36  SMD_R0603  [0603']  95.95,25.45 90 top
R37  85.37,28.8 180 top
R38  53.88,43.6 180 top
R39  89.34,31.65 180 top
R40  89.32,33.23 180 top
R41  6.2K  [0603']  27.52,34.85 270 top
R42  36K  [0603']  26.45,41.4 0 top
R43  4.7K  [0603']  27.57,33.1 90 top
R44  [0603']  84.64,17.38 90 top
R45  16.94,61.98 0 top
R46  SMD_R0603  [0603']  94.5,11.03 0 top
R47  24.48,64.59 270 top
R48  21.77,64.52 270 top
R49  120R  [0603']  90.25,46.58 90 top
R50  10K  [0603']  89.2,40.8 270 top
R51  43.87,59.45 0 top
R52  39.55,59.48 0 top
R53  11.07,14.75 270 top
R54  10K  [0603']  92.02,68.67 180 top
R55  4.7K  [0603']  65.27,43.58 90 top
R56  SMD_R0603  [0603']  80.39,44.58 270 top
R57  SMD_R0603  [0603']  73.82,44.6 270 top
R58  SMD_R0603  [0603']  77.14,44.6 270 top
RESET  53.8,48.5 180 top
U1  30.71,57 0 top
U2  17.12,56.87 0 top
U$1  100,0 90 top
U$3  [EAGLE-PLC-10MM]  75.95,31.61 0 top
X1  14.37,4.2 90 top
X2  84.97,75 270 top
X3  10.67,46.46 90 top
X4  10.67,24.36 90 top
X5  71.89,37.15 0 top
XT1  52.36,34.75 180 top
XT2  40.17,52.26 180 top

### Tracks (layer width: path | path; a pad name or v marks a point on that pad's centre or on a via)
1WIRE  (via drill 0.35)
  Top 0.203: D5.A 9.15,13.3 8.05,13.3 v8,13.25 3.22,13.25 JP2.2 | D5.A 10.65,13.45 R53.2 | v47.84,34.9 47.87,34.92 47.87,36.1 49,37.23 53.96,37.23 54.34,37.61 54.34,38.61 55.17,39.45 IC3.6 | D5.A D4.K | v16.62,23.77 14,21.15 v10.77,21.15
  Bottom 0.203: v47.84,34.9 47.84,33.27 45.37,30.8 21.82,30.8 16.62,25.6 v16.62,23.77 | v10.77,21.15 10.77,18.43 7.97,15.62 7.97,13.28 v8,13.25
+5V
  Top 0.203: P5.1 25.67,48.82 | C9.2 R42.1 26.45,43.7 27,44.25
  Top 0.457: P5.1 26.4,48.29
  Top 0.61: 26.27,44.73 26.4,44.85 | C10.2 26.05,45.38 26.4,45.38
  Top 0.914: L2.2 40.3,46.12 | 40.3,46.12 C8.+ | 40.3,46.12 40.3,44 39.34,43.05 28.2,43.05 27,44.25 26.4,44.85 26.4,45.38 26.4,48.29
+24V  (via drill 0.35)
  Top 0.457: C19.1 35.47,33.95 v35.5,33.92 | R43.1 v26.82,31.98
  Top 0.61: IC4.5 C19.1
  Top 1: C2.+ 21.47,36.94 F1.P$2
  Bottom 0.457: v35.5,33.92 35.5,32.7 34.77,31.98 v26.82,31.98 24.2,31.98 F1.P$2
AD0  (via drill 0.35)
  Top 0.203: P1.MM v90.47,16.27 | IC2.21 92.19,25.33 v92.3,25.23
  Bottom 0.203: v92.3,25.23 92.3,20.47 92.33,20.44 92.33,18.13 v90.47,16.27
CAN_!CS  (via drill 0.35)
  Top 0.203: R47.1 27.28,65.35 28.17,64.47 U1.16 28.17,60.4 31.93,56.64 v32.37,56.64 | IC3.2 55.36,41.45 55.14,41.67 47.76,41.67 v47.18,41.09
  Bottom 0.203: v32.37,56.64 32.57,56.64 32.62,56.59 37.93,56.59 47.18,47.34 v47.18,41.09
CAN_!INT
  Top 0.203: R48.1 21.77,66.29 22.02,66.55 32.18,66.55 33.25,65.48 U1.12 33.25,59.1 34.75,57.6 41.73,57.6 46.8,52.54 46.8,43.12 47.88,42.03 55.43,42.03 55.5,41.96 | 55.5,41.96 IC3.1 55.51,41.95 55.5,41.96
CANH
  Top 0.457: U2.7 16.49,60.31 16.5,60.33 16.5,61.66 R45.1 16.08,62.08 14.82,62.08 12.94,63.96 X3.U$6 X3.P$6
CANL
  Top 0.457: U2.6 17.76,61.92 | 17.76,61.92 R45.2 | X3.P$7 X3.U$7 11.9,66.23 11.9,66.15 14.4,63.65 16.92,63.65 17.76,62.81 17.76,61.92
GND  (via drill 0.35)
  Top 0.203: C1.2 90.39,28.65 v92.27,28.65 | IC3.5 57.92,39.95 58.42,40.45 IC3.21 C3.1 66.3,40.44 C5.1 68.16,40.36 68.25,40.45 73.14,40.45 | v35.82,53.55 35.79,53.52 U1.9 | 22.02,59.44 C14.1 C13.2 16.52,57.66 | 23.47,49.83 P4.2 | C11.1 50.27,33.65 XT1.2 51.61,34.06 52.37,34.83 | C12.1 53.43,35.52 XT1.4 52.46,35.21 52.46,35.2 52.37,35.11 52.37,34.83 | 52.37,34.83 52.37,34.74 v52.36,34.73 | C6.1 50.05,43.85 50.05,46.62 53.83,50.41 v56.61,50.41 56.88,50.41 56.97,50.5 RESET.2 | v92.5,30.62 91.47,31.65 R39.1 90.2,31.68 R40.1 91.02,33.23 91.39,33.6 LCD1.1 92.8,33.58 v94.8,33.58 94.8,31.07 LCD1.M1 | LCD1.12 95,44.6 v95.34,44.25 | v95.37,47.55 95.37,49.5 LCD1.M2 | 73.14,40.45 X5.GND | 73.14,40.45 73.69,40.99 78.48,40.99 v78.59,40.88 | 16.52,57.66 16.45,57.66 | U2.8 15.22,57.91 15.46,57.66 | U2.2 v16.49,57.62 | v16.49,57.62 16.52,57.66 | JP2.3 3.96,10.29 5.02,9.22 D4.A 9.15,9.32 | v3.77,24.38 3.8,24.35 | IC5.5 69.77,45.4 69.55,45.17 v67.75,45.17 67.7,45.23 C17.1 | C4.1 49.98,38.51 C18.2 v51.52,38.5 | 16.42,57.66 16.45,57.66 | 16.45,57.66 v16.49,57.62 | C15.1 42.34,53.36 XT2.4 40.25,52.69 v40.25,52.27 40.25,51.99 XT2.2 38.91,51.68 C16.1 | JP1.3 97.63,64.91 95.87,63.15 95.87,54.92 v95.7,54.75 | Q1.2 89.95,42.17 R50.1 89.95,38.95 89.77,38.77 86.17,38.77 85.7,39.25 v85.7,39.52 | P1.11 89.2,16.41 v89.07,16.27 | K1.2 83.06,19.87 v83.09,19.9 83.31,20.12 IC2.12 | R46.1 94.47,11.75 93.22,11.75 v92.97,11.5
  Top 0.305: IC6.2 83.75,47.52 v83.72,47.5 | C20.1 v86.27,45.4
  Top 0.4: 57.92,39.95 v58.27,39.6 | X3.U$2 13.92,53.21 13.92,56.77 14.8,57.66 15.46,57.66 16.42,57.66 C13.2 | v16.07,47.7 20.95,47.7 21.5,48.25 21.5,49.25 22.07,49.83 23.47,49.83
  Top 0.5: v3.77,24.38 3.72,24.43 3.72,41.58 8.87,46.73 8.87,49.96
  Top 0.8: v16.07,47.7 14.6,47.7 12.34,49.96 X3.U$2 8.87,49.96 X3.P$2
  Bottom 0.203: 92,20.3 91.87,20.18 | v52.36,34.73 52.47,34.84 | v95.34,44.25 95.34,47.52 v95.37,47.55 | BAT1.P$2 78.3,37.21 78.3,40.58 v78.59,40.88 | JP2.3 5.36,10.29 5.82,10.75 5.82,16.77 3.77,18.82 v3.77,24.38 | v67.75,45.17 67.75,45.27 65.19,47.83 59.19,47.83 v56.61,50.41 54.08,52.95 OK2.3 | v51.52,38.5 51.52,39.02 | v35.82,53.55 35.83,53.56
  Bottom 0.4: v92.27,28.65 92.05,28.88 92.05,30.17 v92.5,30.62 92.04,31.08 92.04,50.77 94.77,53.5 94.77,55.6 93.67,56.7 90.87,56.7 89.36,55.19 OK8.3 | 16.17,47.6 v16.07,47.7
  Bottom 0.5: LD17.K 6.99,41.08 4.07,44 4.07,49.2 5.67,50.8 X3.P$2
  pour Bottom: 6.97,71 10.97,71 12.52,69.45 12.52,66.53 13.8,65.25 43.4,65.25 48.42,60.23 96.45,60.23 99.67,57 99.67,9 98.67,8 91.67,8 86.67,13 81.67,13 79.17,15.5 17.9,15.5 13.17,20.23 13.17,35.88 10.52,38.52 5.65,38.52 3.77,40.4 3.77,67.8
IN1  (via drill 0.35)
  Top 0.203: v86.67,20.7 87.31,20.06 88.07,20.06 88.13,20.12 IC2.13 91.46,20.12 94.2,17.39 94.2,15.93 R34.1 | v86.77,50.63 86.77,51.2 86.48,51.49 62.78,51.49 61.95,52.33 51.84,52.33 50.94,53.23 OK1.4 | IC3.22 61.97,40.95 62.52,41.5 78.84,41.5 79.59,40.75 v79.59,40.35
  Bottom 0.203: v86.67,20.7 86.67,21.24 84.89,23.02 84.89,27.85 88.17,31.13 88.17,41.5 | 88.17,41.5 88.17,49.24 v86.77,50.63 | v79.59,40.35 79.59,40.88 80.2,41.48 88.14,41.48 88.17,41.5
IN2  (via drill 0.35)
  Top 0.203: v87.76,20.79 87.78,20.78 IC2.14 91.27,20.78 94.57,17.48 94.57,16.7 95.05,16.23 R33.1 | v87.78,50.63 87.78,51.53 87.37,51.94 62.99,51.94 62.12,52.81 59.02,52.81 OK2.4
  Bottom 0.203: v87.76,20.79 85.35,23.21 85.35,27.66 88.63,30.94 88.63,50.01 88.01,50.63 v87.78,50.63
IN3  (via drill 0.35)
  Top 0.203: v87.72,21.87 88.18,21.41 IC2.15 91.11,21.41 94.9,17.62 95.2,17.62 R32.1 | v88.89,50.63 88.89,50.86 88.77,50.98 88.77,51.2 87.57,52.4 63.37,52.4 62.87,52.9 62.87,54.61 OK3.4
  Bottom 0.203: v87.72,21.87 | v87.72,21.87 85.81,23.79 85.81,27.47 89.08,30.75 89.08,50.63 v88.89,50.63
IN4  (via drill 0.35)
  Top 0.203: v87.75,22.88 88.56,22.07 IC2.16 91.75,22.07 94.9,18.93 R31.1
  Bottom 0.203: v87.75,22.88 | v87.75,22.88 86.26,24.37 86.26,27.28 89.54,30.56 89.54,50.92 89.05,51.42 76.08,51.42 75.35,52.15 69.82,52.15 68.11,53.85 OK4.4
IN5  (via drill 0.35)
  Top 0.203: IC2.17 88.94,22.73 87.77,23.9 | IC2.17 88.93,22.73 v87.67,24 | IC2.17 91.66,22.73 94.15,20.25 R30.1
  Bottom 0.203: v87.67,24 87.67,24.32 86.72,25.27 86.72,27.09 90,30.37 90,50.95 89.17,51.77 76.2,51.77 73.97,54.01 OK5.4
IN6  (via drill 0.35)
  Top 0.203: v87.73,25.3 88.01,25.02 88.01,24.7 89.34,23.37 IC2.18 92.43,23.37 94.22,21.57 R29.1
  Bottom 0.203: v87.73,25.3 87.73,25.74 87.18,26.3 87.18,26.9 90.46,30.18 90.46,50.96 89.3,52.12 81.25,52.12 79.94,53.43 OK6.4
IN7  (via drill 0.35)
  Top 0.203: v87.91,26.6 87.91,26.26 88.47,25.7 88.47,24.89 89.32,24.03 IC2.19 92.77,24.03 93.97,22.82 95.09,22.82 95.12,22.85 R28.1
  Bottom 0.203: v87.91,26.6 88.19,26.88 88.19,26.91 90.91,29.64 90.91,50.98 89.39,52.5 88,52.5 86.87,53.62 86.87,54.21 OK7.4
IN8  (via drill 0.35)
  Top 0.203: v88.92,26.61 88.92,25.08 89.31,24.69 90.26,24.69 IC2.20 92,24.66 92.04,24.62 93.28,24.62 93.75,24.15 R27.1
  Bottom 0.203: v88.92,26.61 91.25,28.93 91.25,50.99 91.84,51.59 OK8.4
INT  (via drill 0.35)
  Top 0.203: IC3.32 56.52,43.58 56.3,43.8 56.3,45.78 v56.15,45.93 | v97.8,28.48 97.05,29.23 92.81,29.23 91.88,30.16 82.63,30.16 82.62,30.14 v82.23,30.14 | X3.P$5 X3.U$5 | IC2.1 83.41,27.28 83.12,27.57 v83.12,28.82 83.14,28.8 R37.2
  Bottom 0.203: v56.15,45.93 56.19,45.88 58.89,45.88 62.15,42.62 75.66,42.62 77.77,40.57 77.77,36.01 82.23,31.52 v82.23,30.14 83.12,29.25 v83.12,28.82 | X3.U$5 10.67,61.38 13.78,64.49 43.1,64.49 48.65,58.95 94.12,58.95 98.69,54.38 98.69,29.8 97.8,28.9 v97.8,28.48
LCD_!EN
  Top 0.203: IC3.12 58.14,37.73 58.14,35.58 59.36,34.35 63.47,34.35 64.46,33.36 82.88,33.36 83.72,34.2 90.42,34.2 90.45,34.17 91.09,34.17 91.52,34.6 LCD1.2
LCD_!RST
  Top 0.203: LCD1.3 92.7,35.52 91.44,35.52 89.73,37.24 83.69,37.24 79.05,41.88 62.34,41.88 62.03,41.57 60.74,41.57 IC3.23
LCD_BLK
  Top 0.203: R49.1 89.14,46.2 Q1.3
LCD_CLK
  Top 0.203: LCD1.6 90.81,38.6 90.11,37.9 84.1,37.9 79.42,42.58 62.32,42.58 61.65,43.25 60.17,43.25 60.02,43.1 IC3.25
LCD_D/C
  Top 0.203: IC3.24 61.95,41.95 62.22,42.23 79.2,42.23 83.85,37.57 89.86,37.57 90.75,36.69 92.68,36.69 LCD1.4
LCD_DATA
  Top 0.203: LCD1.7 91.34,39.6 89.98,38.23 84.24,38.23 79.56,42.91 62.46,42.91 61.17,44.2 60.27,44.2 59.52,43.45 IC3.26
MISO  (via drill 0.35)
  Top 0.203: IC3.16 60.02,37.5 60.94,36.58 62.64,36.58 v62.93,36.87 | U1.15 29.44,60.94 34.08,56.3 41.41,56.3 45.8,51.92 45.8,33.88 47.93,31.75 61.72,31.75 v62.87,32.9 | v62.93,36.87 62.93,36.81 | v62.93,36.87 66.39,36.87 67.94,38.42 X5.MISO
  Bottom 0.203: v62.87,32.9 62.87,36.81 v62.93,36.87
MOSI  (via drill 0.35)
  Top 0.203: IC3.15 59.52,37.35 61.03,35.84 v61.67,35.84 v61.67,35.85 64.69,35.85 65.76,34.78 69.73,34.78 X5.MOSI | U1.14 30.71,60.32 34.31,56.71 41.53,56.71 46.13,52.11 46.13,34.26 48.18,32.21 60.86,32.21 61.55,32.9 v61.57,32.9
  Bottom 0.203: v61.67,35.85 61.67,33 v61.57,32.9
N$1
  Top 0.203: 18.42,11.2 R1.1
  Top 0.5: R1.1 15.89,11.25 LD1.K
N$2
  Top 0.5: R2.1 26.19,11.25 LD2.K
N$3
  Top 0.5: R3.1 35.49,11.25 LD3.K
N$4
  Top 0.5: R4.1 45.79,11.25 LD4.K
N$5
  Top 0.5: R5.1 56.09,11.25 LD5.K
N$6
  Top 0.5: R6.1 66.39,11.25 LD6.K
N$7
  Top 0.5: R7.1 78.22,11 LD7.K
N$8
  Top 0.203: LD8.K 85.99,11.25 86.19,11.25
  Top 0.25: 86.19,11.25 R8.1
N$9  (via drill 0.35)
  Top 0.6: R8.2 88.47,5.64 X1.PIN16 | v25.42,20.25 25.17,20.25 24.75,19.83 IC1.18
  Bottom 0.6: v25.42,20.25 24.67,19.5 24.67,16.5 25.17,16 60.17,16 62.17,14 78.67,14 80.92,11.75 80.92,10.31 X1.PIN16
N$10  (via drill 0.35)
  Top 0.6: R7.2 78.47,5.64 X1.PIN14 | v23.42,20.25 23.48,20.19 IC1.17
  Bottom 0.6: v23.42,20.25 23.42,16.62 25.05,15 59.42,15 61.42,13 69.42,13 71.17,11.25 71.17,9 75.97,4.2 X1.PIN14
N$11  (via drill 0.35)
  Top 0.6: R6.2 68.47,5.8 X1.PIN12 | v21.42,20.25 21.67,20.25 22.21,19.71 IC1.16
  Bottom 0.6: v21.42,20.25 22.17,19.5 22.17,16.73 24.9,14 58.92,14 61.42,11.5 61.42,9 66.22,4.2 X1.PIN12
N$12  (via drill 0.35)
  Top 0.6: R5.2 58.47,5.8 X1.PIN10 | v49.92,12.5 42.92,12.5 39.42,16 21.42,16 20.94,16.48 IC1.15
  Bottom 0.6: v49.92,12.5 50.67,11.75 50.67,9.5 55.97,4.2 X1.PIN10
N$13  (via drill 0.35)
  Top 0.6: R4.2 48.47,5.8 X1.PIN8 | v40.42,12.5 40.42,13.5 38.92,15 20.67,15 19.67,16 IC1.14
  Bottom 0.6: v40.42,12.5 40.42,9.75 45.97,4.2 X1.PIN8
N$14  (via drill 0.35)
  Top 0.203: IC1.13 18.42,18.06
  Top 0.6: R3.2 38.47,5.8 X1.PIN6 | 18.42,18.08 18.42,18.06 18.42,15.5 19.92,14 29.42,14 30.17,13.25 v30.17,12.5
  Bottom 0.6: v30.17,12.5 30.17,10 35.97,4.2 X1.PIN6
N$15  (via drill 0.35)
  Top 0.6: R2.2 28.47,5.8 X1.PIN4 | v19.67,12.75 19.42,12.75 17.13,15.04 IC1.12
  Bottom 0.6: v19.67,12.75 20.67,12.75 21.67,11.75 21.67,9.25 23.67,7.25 25.17,7.25 26.87,5.55 X1.PIN4
N$16  (via drill 0.35)
  Top 0.6: R1.2 18.47,5.8 X1.PIN2 | v15.92,13.5 15.86,13.56 IC1.11
  Bottom 0.6: X1.PIN2 16.87,9.36 17.55,10.04 17.55,11.87 v15.92,13.5
N$17
  Top 0.203: LD17.A 10.74,41.08 10.75,41.08 11.62,41.08 R9.1
N$18
  Top 0.203: LD18.A 9.88,19 R10.1
  Top 0.3: R10.1 10.78,19
N$19
  Top 0.3: R18.2 81.5,74.03 X2.PIN2
N$20
  Top 0.3: R17.2 72.05,74.58 X2.PIN4
N$21
  Top 0.3: R16.2 61.7,74.22 X2.PIN6
N$22
  Top 0.3: R15.2 51.47,74 X2.PIN8
N$23
  Top 0.3: R14.2 41.55,74.08 X2.PIN10
N$24
  Top 0.3: R13.2 31.57,74.1 X2.PIN12
N$25
  Top 0.3: R12.2 21.42,74.11 X2.PIN14
N$26
  Top 0.203: X2.PIN16 14.66,72.65 R11.2
N$27
  Top 0.203: LD9.K 16.28,68 15.8,67.52 R11.1
N$28
  Top 0.203: R12.1 25.58,68.03 LD10.K
N$29
  Top 0.203: R13.1 35.58,68.03 LD11.K
N$30
  Top 0.203: R14.1 45.18,68.03 LD12.K
N$31
  Top 0.203: R15.1 55.52,68.08 LD13.K
N$32
  Top 0.203: R16.1 65.48,68.12 LD14.K
N$33
  Top 0.203: R17.1 75.53,68.08 LD15.K
N$34
  Top 0.203: R18.1 85.48,68.12 LD16.K
N$35
  Bottom 0.3: OK1.2 48.42,62.83 48.42,64.25 47.67,65 45.17,65 44.17,66 29.92,66 29.42,66.5 20.4,66.5 LD9.A
N$36
  Bottom 0.3: OK3.2 59.77,62.83 59.77,65.65 58.92,66.5 45.15,66.5 44.6,67.05 39.09,67.05 LD11.A
N$37
  Top 0.3: OK5.2 71.42,65.05 69.67,66.8 59.34,66.8 LD13.A
N$38
  Top 0.3: OK7.2 83.33,64.92 82.32,65.92 80.22,65.92 LD15.A
N$39
  Top 0.3: OK8.2 89.3,66.84 LD16.A
N$40
  Top 0.3: 77.4,65.05 OK6.2 | LD14.A 68.79,67.35 69.9,67.35 71.45,65.8 75.14,65.8
  Top 0.305: 75.14,65.8 76.65,65.8 77.4,65.05
N$41
  Top 0.3: OK4.2 65.58,65.19 64.77,66 49.74,66 LD12.A
N$42
  Bottom 0.3: OK2.2 54.08,64.59 52.92,65.75 45.17,65.75 44.42,66.5 30.2,66.5 29.65,67.05 29.09,67.05 LD10.A
N$43
  Top 0.203: IC2.4 83.62,25.33 81.8,27.15 81.8,29.25 79.97,31.07 R19.2
N$44
  Top 0.25: IC1.8 15.86,26.26 21.02,21.1 27.07,21.1 27.9,20.27 OK9.3
N$45
  Top 0.25: IC1.7 17.13,26.32 21.75,21.7 32.47,21.7 33.9,20.27 OK13.3
N$46
  Top 0.25: IC1.6 18.47,27.83 18.47,26.1 22.37,22.2 36.89,22.2 OK10.3
N$47
  Top 0.25: IC1.5 19.67,25.8 22.76,22.71 37.09,22.71 39,20.8 44.29,20.8 OK14.3
N$48
  Top 0.25: IC1.4 20.94,25.43 23.16,23.21 37.3,23.21 39.21,21.3 49.79,21.3 OK11.3
N$49
  Top 0.25: IC1.3 22.21,24.96 23.45,23.72 37.51,23.72 39.42,21.81 55.28,21.81 OK15.3
N$50
  Top 0.25: IC1.2 23.48,24.91 24.17,24.22 37.72,24.22 39.63,22.31 60.78,22.31 OK12.3
N$51
  Top 0.25: IC1.1 24.75,25.02 25.05,24.72 37.93,24.72 39.84,22.82 66.27,22.82 OK16.3
N$52
  Top 0.203: IC2.5 83.62,24.66 81.34,26.95 81.34,28.6 80.19,29.75 R20.2
N$53
  Top 0.203: IC2.6 83.58,24.03 80.59,27.02 80.59,27.73 79.95,28.38 R21.2
N$54
  Top 0.203: IC2.7 83.59,23.37 79.91,27.05 R22.2
N$55
  Top 0.203: IC2.8 83.58,22.73 80.59,25.73 R23.2
N$56
  Top 0.203: IC2.9 83.55,22.07 81.2,24.43 R24.2
N$57
  Top 0.203: IC2.10 83.58,21.41 81.87,23.12 R25.2
N$58
  Top 0.203: 84.32,20.65 IC2.11 83.44,20.78 82.42,21.8 R26.2
N$59
  Top 0.203: LCD1.14 90.89,46.6 R49.2
N$60
  Top 0.203: IC3.20 63.12,39.95 64.17,38.9 C3.2
N$61
  Top 0.203: 68.42,46.95 IC5.3 66.47,47 D1.K | 66.42,49.2 D3.K 66.34,47.12 D1.K | D1.K C17.2 64.51,44.63 64.71,44.43 70.45,44.43 72.14,46.12 Q3.1 72.92,44.75 R57.2 73.59,44.6 73.87,44.33 73.87,43.98 74.02,43.83 76.37,43.83 | Q2.1 79.42,44.8 R56.2 79.64,44 79.47,43.83 76.37,43.83 | Q4.1 76.17,44.83 R58.2 76.39,43.85 76.37,43.83
N$62  (via drill 0.35)
  Top 0.203: 63.62,49.35 D3.A 63.12,49.12 v62.57,48.58
  Bottom 0.203: v62.57,48.58 62.95,48.58 63.95,49.58 BAT1.P$1
N$63
  Top 0.61: IC4.1 30.85,37.16 C7.1
N$64
  Top 0.61: 35.05,35.92 34.92,35.8 IC4.6 33.72,35.8 34.45,36.52 | C7.2 34.37,37.55 34.45,37.62
  Top 0.914: L2.1 33.62,40.12 34.45,39.3 34.45,37.62 34.45,36.52 35.05,35.92 37.82,35.92 D2.C
N$65
  Top 0.203: 30.82,33.88 IC4.3 26.95,33.9 26.75,34.1 26.75,34.83 R41.2 26.77,37.7 26.45,38.02 R42.2 C9.1
N$66
  Top 0.203: IC4.4 32.62,33.9 31.82,33.1 R43.2
N$67  (via drill 0.35)
  Top 0.203: LD21.2 96.25,12.38 95.25,13.38 86.62,13.38 84.07,15.93 80.02,15.93 78.3,17.65 77.3,17.65
  Top 0.305: K1.4 76.98,17.33 77.3,17.65 77.3,20.27 v77.27,20.3
  Bottom 0.305: v77.27,20.3 77.22,20.35 77.22,24.15 74.56,26.81 OK16.1 72.44,28.75 71.72,29.48 66.25,29.48 | OK9.1 30.44,29 30.92,29.48 36.52,29.48 | 66.25,29.48 60.52,29.48 | 60.52,29.48 54.37,29.48 | 54.37,29.48 48.55,29.48 | 48.55,29.48 42.45,29.48 | 42.45,29.48 36.52,29.48 | OK13.1 36.44,29.39 36.52,29.48 | OK10.1 42.44,29.47 42.45,29.48 | OK14.1 48.44,29.37 48.55,29.48 | OK11.1 54.44,29.41 54.37,29.48 | OK15.1 60.44,29.39 60.52,29.48 | OK12.1 66.44,29.28 66.25,29.48
N$68
  Top 0.203: LD19.K- 88.45,31.68 R39.2
N$69
  Top 0.203: XT1.1 53.82,33.65 54.17,34 C12.2 55.55,34 56.05,34.5 56.05,36.48 55.82,36.7 55.67,36.7 55.32,37.05 55.32,38.27 55.5,38.45 IC3.8
N$70
  Top 0.203: C11.2 49.84,35.85 XT1.3 51.61,36.46 51.92,36.77 54.4,36.77 54.82,37.2 54.82,38.45 55.32,38.95 IC3.7
N$71  (via drill 0.35)
  Top 0.203: IC3.14 59.02,37.05 59.99,36.08 v59.99,35.83 | v65.82,35.73 65.89,35.73 67.29,37.12 69.87,37.12 X5.NC3
  Bottom 0.203: 59.99,35.87 v59.99,35.83 59.99,36.72 61.34,38.07 63.23,38.07 65.58,35.73 v65.82,35.73
N$72
  Top 0.203: LD20.K- R40.2
N$73
  Top 0.305: K1.1 81.86,17.38 R44.1
N$74
  Top 0.203: U2.1 15.22,52.53 15.67,52.07 25.62,52.07 U1.1
N$75
  Top 0.203: R46.2 96.22,10.28 LD21.1
N$76
  Top 0.203: IC3.10 57.02,34.46 57.46,34.02 63.32,34.02 64.31,33.03 83.38,33.03 83.57,33.23 LD20.A+ 84.62,33.23
N$77
  Top 0.203: IC3.9 56.52,34.48 57.31,33.69 63.1,33.69 64.12,32.67 83.07,32.67 84.07,31.68 LD19.A+
N$78
  Top 0.203: U2.4 20.11,53.09 22.78,53.09 23.55,53.85 26.34,53.85 26.9,53.29 U1.2
N$79  (via drill 0.35)
  Top 0.203: R58.1 78.05,44.75 78.05,46.1 Q4.2 78,46.2 78,46.98 77.42,47.55 76.11,47.55 76.1,47.55 72.7,47.55 v71.95,48.3 | v67.47,47.95 67.47,48.62 67.64,48.8 IC5.1
  Bottom 0.203: v71.95,48.3 67.82,48.3 v67.47,47.95
N$80
  Top 0.203: C16.2 37.84,53.36 XT2.3 39.42,54.03 38.97,54.48 33.8,54.48 33.25,53.93 U1.7
N$81
  Top 0.203: 34.47,52.03 U1.8 34.52,50.65 35.07,50.1 40.55,50.1 40.92,50.47 XT2.1 42.25,51.16 C15.2
N$82
  Top 0.203: LD22.K- 44.75,62.12 R51.2
N$83
  Top 0.203: LD23.K- 40.45,59.5 R52.2
N$85
  Top 0.203: R57.1 74.82,44.85 Q3.2 74.82,46.83 74.5,47.15 72.12,47.15 70.47,48.8 IC5.8
N$86  (via drill 0.35)
  Top 0.203: R56.1 81.32,44.75 Q2.2 81.27,46.08 v80.39,46.08 | IC5.6 70.55,47 v71.02,46.52
  Bottom 0.203: v71.02,46.52 79.95,46.52 v80.39,46.08
OUT1
  Top 0.203: OK9.2 27.9,29.13 28.35,29.57 31.08,29.57 31.09,29.56 32.66,29.56 33.29,30.19 39.79,30.19 40.7,31.1 77.92,31.1 R19.1
OUT2
  Top 0.203: OK13.2 33.9,29 34.76,29.86 40.05,29.86 40.95,30.76 75.44,30.76 76.45,29.75 R20.1
OUT3
  Top 0.203: OK10.2 39.9,29.08 41.2,30.38 74.7,30.38 76.7,28.38 R21.1
OUT4
  Top 0.203: OK14.2 45.9,29.03 46.89,30.02 74.41,30.02 77.37,27.05 R22.1
OUT5
  Top 0.203: OK11.2 51.9,28.88 52.71,29.69 74.03,29.69 76.5,27.22 76.5,26.23 77,25.73 R23.1
OUT6
  Top 0.203: R24.1 77.67,24.73 68.59,24.73 68.02,25.3 65.87,25.3 65.14,26.02 65.14,28.52 64.32,29.35 58.4,29.35 57.9,28.86 OK15.2
OUT7
  Top 0.203: OK12.2 63.9,26.41 65.62,24.68 67.95,24.68 68.84,23.8 76.8,23.8 77.47,23.12 R25.1
OUT8  (via drill 0.35)
  Top 0.203: v75.2,23.19 75.68,23.19 77.07,21.8 R26.1
  Bottom 0.203: OK16.2 69.9,25.34 70.36,24.88 73.51,24.88 v75.2,23.19
OUT_EN  (via drill 0.35)
  Top 0.203: R44.2 85.39,18.18 85.09,18.48 79.89,18.48 79,19.38 v79,20.25 | v57.82,34.73 57.52,35.02 IC3.11
  Bottom 0.203: v79,20.25 78.8,20.45 78.8,30.92 77.95,31.77 59.96,31.77 58.42,33.3 58.42,34.12 v57.82,34.73
PE2  (via drill 0.35)
  Top 0.203: v63.07,38.9 62.52,39.45 IC3.19 | X5.NC4 69.79,35.78 | 69.79,35.78 69.78,35.77 | v67.58,35.91 67.6,35.9 69.67,35.9 69.79,35.78
  Bottom 0.203: v67.58,35.91 66.7,35.91 65.87,36.73 65.24,36.73 v63.07,38.9
PGND  (via drill 0.35)
  Top 0.203: 23.47,48.82 P4.1 | R41.1 v29.47,34.85 | X4.P$1 5.7,24.34 5.7,20.65 LD18.K
  Top 0.6: IC1.9 14.59,30.04 13.64,30.99
  Top 0.61: v29.47,34.85 IC4.2 v31.97,34.85 | v33.84,32.8 34,32.95 C19.2 | D2.A v40.92,35.4 | P4.1 24.17,48.32 24.17,45.7 C10.1 C2.-
  Top 0.8: 43.15,35.8 D2.A | 14.17,38.2 13.64,37.67 13.64,30.99 12.88,30.23 12.88,29.21 11.53,27.86 X4.U$2 | X4.P$2 X4.U$2 | X4.P$1 X4.U$1 X4.U$2
  Top 0.914: D2.A 42.75,39 42.2,39.55 C8.-
  Top 1: 14.17,38.2 15.07,39.1 15.07,43.6 16.81,45.34 C2.-
  Bottom 0.61: v31.97,34.85 31.97,33.6 32.77,32.8 v33.84,32.8 | v40.92,35.4 34.17,35.4 33.84,35.73 26.95,35.73 24,38.67 24,41.92 20.58,45.34 C2.- 19.06,44.42 20.3,44.42 23.02,41.7 23.02,38.5 26.67,34.85 v29.47,34.85
  Bottom 0.8: X2.PIN1 87.47,76.7 86.67,77.5 78.17,77.5 77.47,76.8 | X2.PIN3 77.47,76.8 | 77.47,76.8 76.77,77.5 68.67,77.5 67.47,76.3 X2.PIN5 67.47,76.7 66.67,77.5 58.17,77.5 57.47,76.8 X2.PIN7 57.47,76.7 56.67,77.5 48.67,77.5 47.47,76.3 | X2.PIN9 47.47,76.3 | 47.47,76.3 47.47,76.7 46.67,77.5 38.17,77.5 37.47,76.8 | X2.PIN11 37.47,76.8 | 37.47,76.8 36.77,77.5 28.17,77.5 27.31,76.64 | X2.PIN13 27.31,76.64 | 27.31,76.64 27.31,76.86 26.67,77.5 18.17,77.5 17.31,76.64 X2.PIN15 17.31,76.86 16.67,77.5 9.17,77.5 7.42,75.75 7.42,74.8 1.55,68.92 1.55,31.41 5.09,27.86 X4.P$2
PVDD
  Top 0.203: IC1.10 14.59,19 R10.2
  Top 0.25: OK16.4 72.44,12.73 73.3,11.87 73.3,11
  Top 0.5: 21.67,1.5 12.17,1.5 11.87,1.8 X1.PIN1 11.87,9.47 13.1,10.7 13.1,10.8 | 21.67,1.5 31.67,1.5 | 31.67,1.5 41.67,1.5 | 41.67,1.5 51.67,1.5 | 51.67,1.5 61.67,1.5 | 61.67,1.5 72.17,1.5 | 72.17,1.5 79.33,1.5 X1.PIN15 82.03,9.83 LD8.A | 72.17,1.5 72.17,4.06 X1.PIN13 72.03,9.73 73.3,11 LD7.A | 61.67,1.5 61.87,1.7 X1.PIN11 61.87,9.47 63.4,11 LD6.A | 51.67,1.5 51.87,1.7 X1.PIN9 51.87,9.57 LD5.A | 41.67,1.5 41.87,1.7 X1.PIN7 41.87,9.87 LD4.A | 31.67,1.5 31.87,1.7 X1.PIN5 31.87,10.17 LD3.A | 21.67,1.5 21.87,1.7 X1.PIN3 21.87,9.47 LD2.A | 13.1,10.8 LD1.A | 14.59,12.19 13.2,10.8 13.1,10.8
  Top 0.6: IC1.10 14.59,12.19
  Bottom 0.203: OK5.1 73.97,61.2 73.89,61.12 | OK4.1 68.11,61.17 68.07,61.12
  Bottom 0.25: OK9.4 30.44,20.27 31.17,21 36.67,21 | 36.67,21 42.67,21 | 42.67,21 48.67,21 | 48.67,21 54.67,21 | 54.67,21 60.67,21 | 60.67,21 66.67,21 | 66.67,21 71.67,21 72.54,20.13 72.54,19.29 OK16.4 | OK13.4 36.44,20.77 36.67,21 | OK10.4 42.44,20.77 42.67,21 | OK14.4 48.44,20.77 48.67,21 | OK11.4 54.44,20.77 54.67,21 | OK15.4 60.44,20.77 60.67,21 | OK12.4 66.44,20.77 66.67,21
  Bottom 0.3: OK1.1 50.94,61.77 50.92,61.75 51.55,61.12 56.62,61.12 | 56.62,61.12 62.3,61.12 | 62.3,61.12 68.07,61.12 68.11,61.12 73.89,61.12 80.02,61.12 | 80.02,61.12 85.95,61.12 | 85.95,61.12 91.84,61.12 OK8.1 | OK7.1 85.86,61.2 85.95,61.12 | OK6.1 79.94,61.2 80.02,61.12 | OK3.1 62.29,61.13 62.3,61.12 | OK2.1 56.62,61.13 56.62,61.12
  Bottom 0.8: OK3.1 62.29,66.5 56.3,72.5 7.53,72.5 2.7,67.67 2.7,38.22 6.05,34.86 X4.P$4 X4.U$4 | X1.PIN1 11.22,4.85 11.22,11.55 12.72,13.05 12.72,29.31 X4.U$3 | X4.U$4 16.31,34.86 16.37,34.8 | X4.P$3 X4.U$3 | X4.U$3 X4.U$4
  Bottom 1: 16.37,34.8 F1.P$1
PWM1  (via drill 0.35)
  Top 0.203: 88.25,42.42 Q1.1 88.45,42.08 R50.2 87.87,40.8 87.16,40.09 87.16,39.83 v86.84,39.5 | IC3.13 58.52,35.9 58.62,35.8 58.73,35.8 v58.75,35.82
  Bottom 0.203: v58.75,35.82 58.75,33.44 60.09,32.1 78.08,32.1 82.71,27.48 83.3,27.48 86.83,31.01 86.83,39.14 86.84,39.15 v86.84,39.5
RESET  (via drill 0.35)
  Top 0.203: IC3.29 58.02,43.84 v58.36,44.17 58.36,46.06 RESET.1 | C6.2 51.34,43.62 53.1,43.62 R38.2 52.59,43.6 | v76.17,40.25 76.17,39.31 76.78,38.7 76.78,37.88 76.05,37.15 X5.RESET | C6.2 51.32,45.7 51.52,45.9 v54.59,45.9 | 26.85,61.86 U1.17 26.9,60.75 31.72,55.92 41.25,55.92 45.1,52.08 45.1,51.1 v44.97,51.1 | v48.82,48.95 48.82,46.52 | 48.82,46.52 RESET.4 | C6.2 51.32,42.92 50.82,42.42 48.65,42.42 48.05,43.02 48.05,44.75 48.82,45.52 48.82,46.52
  Bottom 0.203: v76.17,40.25 74.7,41.73 62.03,41.73 59.58,44.17 v58.36,44.17 58.31,44.22 55.3,44.22 54.59,44.92 v54.59,45.9 | v44.97,51.1 45.19,51.1 47.34,48.95 v48.82,48.95
RTC_INT  (via drill 0.35)
  Top 0.203: v61.47,51.59 61.47,51.2 59.13,48.86 57.76,48.86 56.7,47.8 52.25,47.8 v50.72,46.27 | Q2.3 80.23,48.8 v79.3,48.8 79.3,48.02 79.89,47.42 81.37,47.42 81.95,46.85 81.95,44.05 81.34,43.45 73.57,43.45 73.45,43.58 R55.2 | IC3.3 55.32,40.95 54.97,41.3 48.75,41.3 v48.5,41.04
  Bottom 0.203: v61.47,51.59 61.69,51.81 75.22,51.81 75.94,51.09 78.86,51.09 79.3,50.65 v79.3,48.8 | v48.5,41.04 48.5,44.05 v50.72,46.27
RX0
  Top 0.203: U1.11 34.52,63.67 35.05,64.2 42.32,64.2 42.95,63.58 LD22.A+
RX1
  Top 0.203: 38.65,62.27 LD23.A+ 38.72,62.25 38.72,63.5 38.48,63.74 36.02,63.74 35.79,63.51 U1.10
RXD
  Top 0.203: IC3.30 57.52,47.3 58.15,47.92 60.49,47.92 60.89,48.33 60.89,49.25 62.44,50.8 85.05,50.8 86.18,49.67 90.24,49.67 94.8,54.23 94.8,69.5 | JP1.1 95.21,69.99 94.8,69.58 94.8,69.5 | R54.2 92.09,69.5 94.8,69.5
SCK  (via drill 0.35)
  Top 0.203: U1.13 31.98,59.7 34.5,57.17 41.57,57.17 46.46,52.27 46.46,34.64 48.44,32.66 59.77,32.66 60.05,32.95 v60.45,32.95 | IC3.17 60.79,38.45 61.65,37.59 v61.65,37.34 61.92,37.61 63.35,37.61 63.62,37.34 66.3,37.34 67.72,38.76 67.72,39.48 67.94,39.69 X5.SCK 68.66,39.69
  Bottom 0.203: v60.45,32.95 60.45,32.98 60.66,33.19 60.66,36.6 61.39,37.34 v61.65,37.34
SCL  (via drill 0.35)
  Top 0.203: IC2.22 93.08,25.99 93.08,25.92 v93.12,25.89 94.03,25.89 94.47,25.45 R36.1 | 72.14,50.47 84.91,50.47 86.04,49.34 90.55,49.34 95.16,53.95 98.06,53.95 v98.09,53.92 | 72.14,50.47 62.76,50.47 61.34,49.06 61.34,46.23 58.52,43.4 IC3.28 | X3.P$4 X3.U$4 | 72.14,50.47 v72.14,49.74 | v73,48.6 73.06,48.66 Q3.3
  Bottom 0.203: v93.12,25.89 93.67,25.89 93.68,25.88 94.29,25.88 98.36,29.95 98.36,53.65 v98.09,53.92 98.09,54.48 93.96,58.6 48.47,58.6 43.04,64.04 14.05,64.04 12.37,62.36 12.37,58.66 X3.U$4 | v72.14,49.74 73,48.89 v73,48.6
SDA  (via drill 0.35)
  Top 0.203: IC2.23 94,26.62 | 94,26.62 93.99,26.61 v93.93,26.61 | 77.14,50.14 84.77,50.14 85.9,49.01 90.87,49.01 94.84,52.98 v97.71,52.98 | 77.14,50.14 73.58,50.14 72.45,49.01 71.84,49.01 70.71,50.14 63.07,50.14 61.82,48.89 61.82,46.23 59.02,43.43 IC3.27 | X3.P$3 X3.U$3 | 77.14,50.14 77.14,48.69 Q4.3 | R35.1 94.13,26.75 94,26.62
  Bottom 0.203: 10.94,53.46 X3.U$3 12.88,55.67 12.88,62.23 14.23,63.58 42.97,63.58 48.28,58.27 93.82,58.27 97.41,54.68 97.41,53.27 v97.71,52.98 97.71,52.66 98.01,52.36 98.01,30.09 94.53,26.61 v93.93,26.61
TXD  (via drill 0.35)
  Top 0.203: IC3.31 57.02,47.48 57.95,48.4 60.01,48.4 60.43,48.83 60.43,49.51 62.07,51.15 85.19,51.15 86.33,50.01 89.92,50.01 94.42,54.5 94.42,67.03 v93.97,67.47
  Bottom 0.203: v93.97,67.47 94,67.45 JP1.2
VCC3V3  (via drill 0.35)
  Top 0.305: C20.2 85.47,47.73 84.7,46.95 IC6.5 84.64,46.05 v83.84,46.05 | v63.15,45.52 63.15,46.38 D1.A
  Bottom 0.305: v83.84,46.05 82.77,44.98 68.48,44.98 68.02,44.52 64.15,44.52 v63.15,45.52
VCC5V  (via drill 0.35)
  Top 0.203: 91.35,27.28 IC2.24 89.29,27.28 89.07,27.5 87.67,27.5 87.37,27.8 87.37,28.4 | 87.37,28.4 86.97,28.8 R37.1 86.25,29.5 86.05,29.7 82.82,29.7 82.27,29.15 82.27,27.32 83.29,26.3 | 87.37,28.4 87.77,28.8 C1.1 | v65.34,39.67 65.53,39.67 C5.2 65.33,37.8 63.71,37.8 63.44,38.07 62.87,38.07 61.98,38.95 IC3.18 | U2.3 17.76,55.68 18.21,56.13 C13.1 | C13.1 21.77,55.12 v21.01,54.36 | C13.1 24.82,56.13 v25.63,56.95 U1.18 | U1.18 25.5,62.04 22.59,62.04 C14.2 | U1.18 25.63,63.45 25.25,63.83 R47.2 21.84,63.83 R48.2 | 52.97,40.42 v53,40.45 IC3.4 | R38.1 53.32,44.92 v53.32,44.95 | 83.29,26.3 83.61,25.99 IC2.3 85.56,25.99 85.87,25.68 85.87,20.05 87.14,18.77 91.3,18.77 91.74,18.33 P1.00 | IC2.2 83.62,26.62 83.29,26.3 | 94.52,45.6 LCD1.13 91.5,45.6 91.07,45.17 91.07,40.73 91.2,40.6 LCD1.8 | v76.05,38.4 73.92,38.4 X5.VTG | v37.37,60.8 38.42,60.8 38.67,60.55 R52.1 | R51.1 43,60.27 v42.45,60.83 | R9.2 10.67,43.84 X3.U$1 | R53.1 10.75,15.95 D5.K 5,15.95 4.41,15.37 JP2.1 1.9,16.27 1.9,44.9 3.46,46.46 X3.P$1 | 62.62,47.12 v62.59,47.1 62.17,46.67 62.17,44.75 63.34,43.58 R55.1 | JP1.4 98.82,61.27 98.82,44.95 | v92,66.42 92,67.9 R54.1
  Top 0.305: K1.3 75.77,19.92 v75.77,21.12 | IC6.3 82.8,49.45 83,49.65 84.37,49.65 84.7,49.33 IC6.1 84.92,48.38 92.64,48.38 93.27,47.75 93.84,47.75 94.52,47.08 94.52,45.6 95.59,45.6 96.25,44.95 98.82,44.95 98.82,27.9 98.47,27.55 96.7,27.55
  Top 0.4: v91.78,27.71 91.35,27.28 | C4.2 53,40.47 v53,40.45 C18.1 | P5.2 26.97,49.77 27.45,49.3 v27.47,49.3
  Top 0.406: v91.78,27.71 91.82,27.75 96.5,27.75 96.7,27.55 R35.2 R36.2 96.72,25.43 R27.2 96.75,24.12 R28.2 R29.2 R30.2 R31.2 R32.2 R33.2 R34.2
  Bottom 0.203: v21.01,54.36 21.01,49.3 | v62.59,47.1 v62.59,47.09 53.02,47.09 52.51,46.58 52.51,45.28 52.84,44.95 v53.32,44.95 53.32,44.55 53,44.23 v53,40.45 53.05,40.4 65.12,40.4 65.34,40.17 v65.34,39.67 65.34,40.12 65.62,40.4 73.97,40.4 75.97,38.4 v76.05,38.4 | v25.63,56.95 28.56,59.88 36.45,59.88 v37.37,60.8 37.4,60.83 v42.45,60.83 | JP1.4 95.93,62.37 95.34,62.95 95.34,65.4 94.37,66.38 92.05,66.38 v92,66.42
  Bottom 0.305: v75.77,21.12 75.13,20.49 75.08,20.49
  Bottom 0.4: 90.09,18.83 76.74,18.83 75.08,20.49 72.97,22.6 16.25,22.6 15.65,23.2 15.65,27.27 19.32,30.95 19.32,35.48 14.77,40.02 14.77,42.35 | v27.47,49.3 28.45,48.33 42.65,48.33 45.52,45.45 45.52,40.73 46.55,39.7 | X3.U$1 10.67,46.45 | 52.25,39.7 v53,40.45
  Bottom 0.406: 46.55,39.7 52.25,39.7 | 90.09,18.83 90.67,19.41 90.67,26.6 v91.78,27.71
  Bottom 0.457: X3.U$1 14.77,42.36 14.77,42.35
  Bottom 0.61: X3.P$1 X3.U$1
  Bottom 0.8: v27.47,49.3 21.01,49.3 13.59,49.3
  Bottom 0.813: 13.59,49.3 13.51,49.3 X3.U$1

### Text on the board
tPlace: RX | +IN8 | TX | +IN4 | +IN5 | +IN6 | +IN7 | +IN1 | +IN2 | +IN3 | Gnd | Vcc | RX1 | RX2 | 5V | 24V | Vcc | +O1- | +O2- | +O3- | +O4- | +O5- | +O6- | +O7- | +O8- | 1W | GND | Created by Ivan Prints. Released 04.10.2020
bPlace: Created by Ivan Prints. Released 04.10.2020